# EAGLE board Revolve_A3 (EAGLE 7.7.0), part 1 of 3
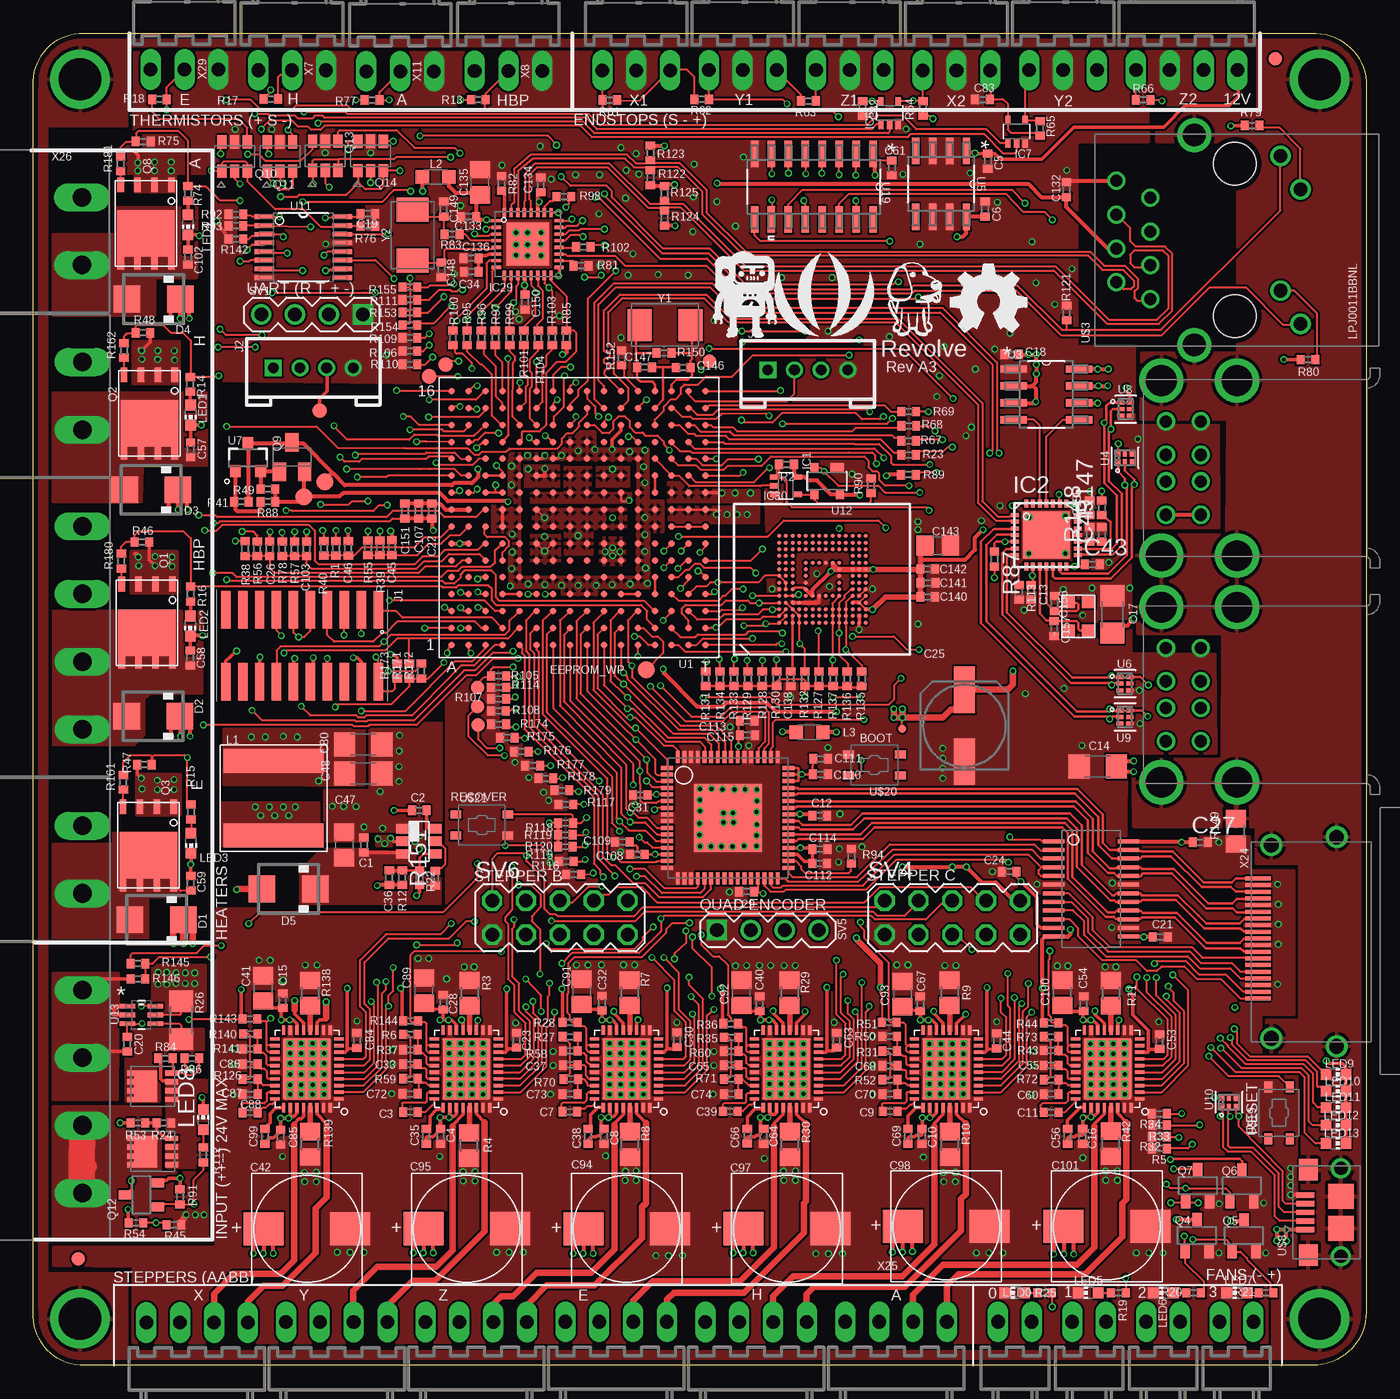
[diagram p9: board, top side]
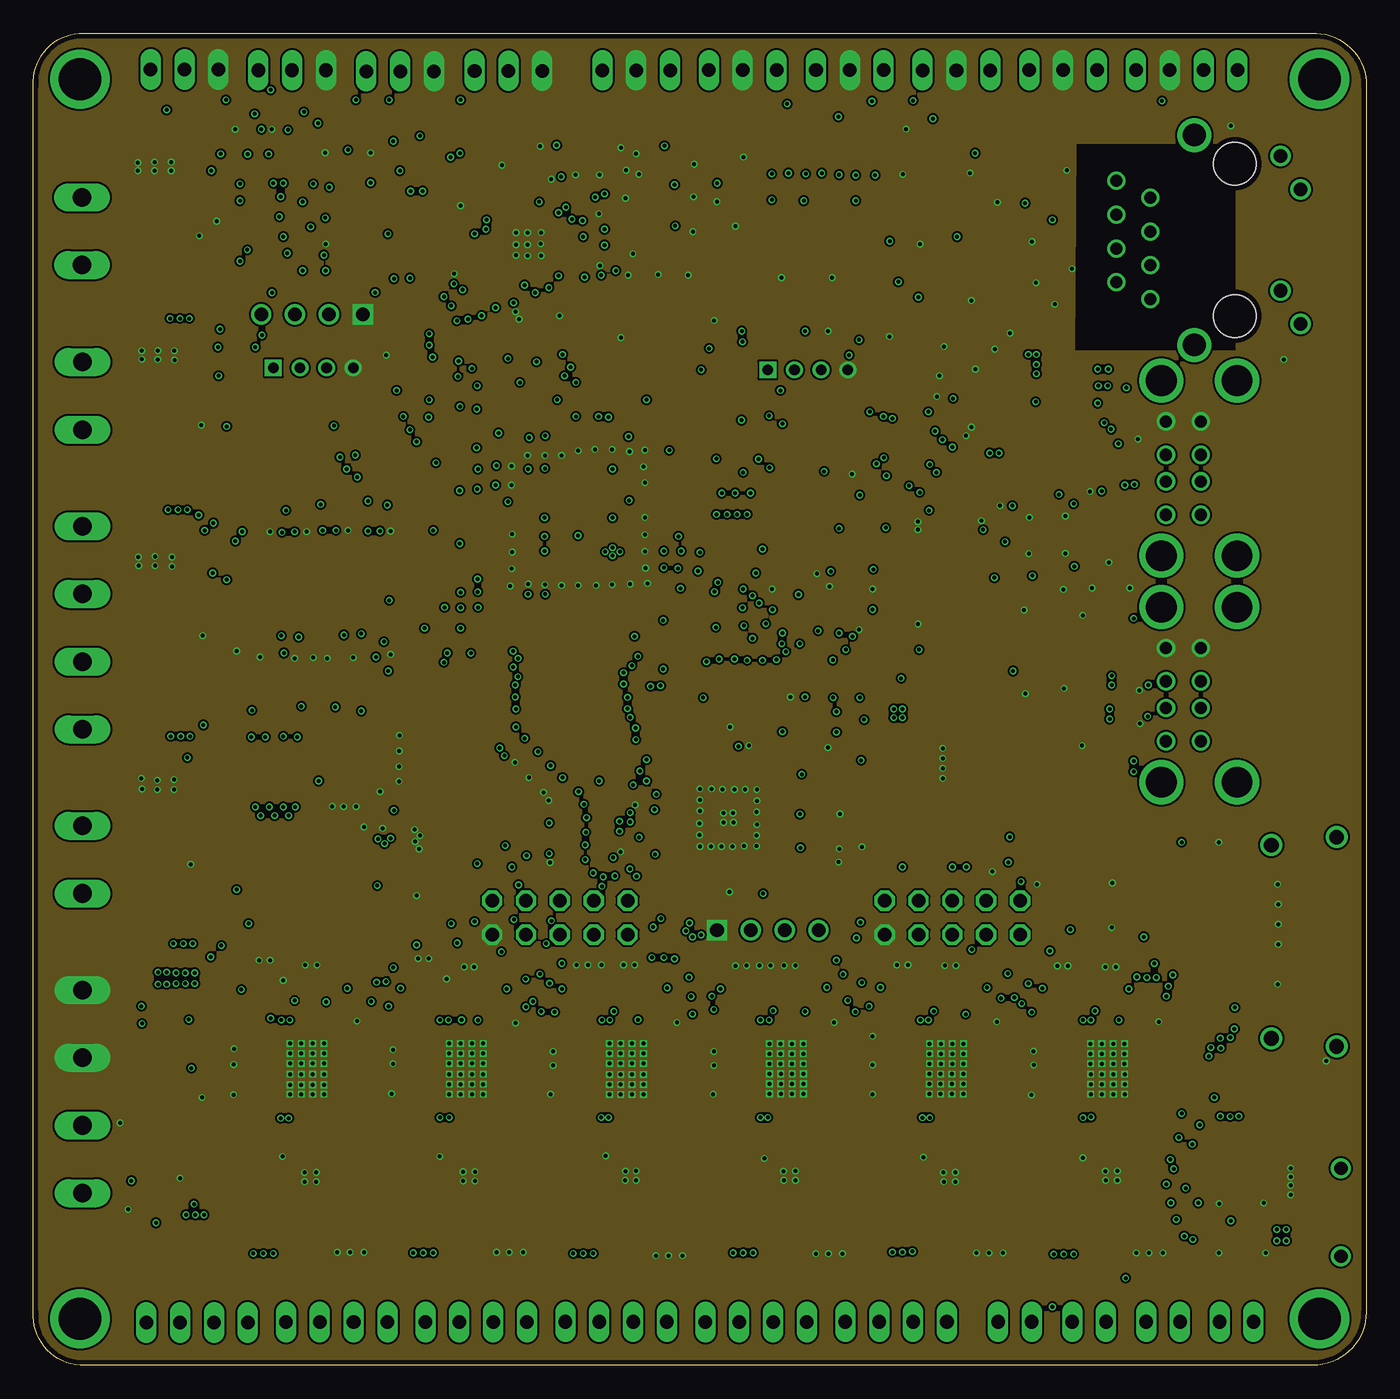
[diagram p10: board, inner layer GND]
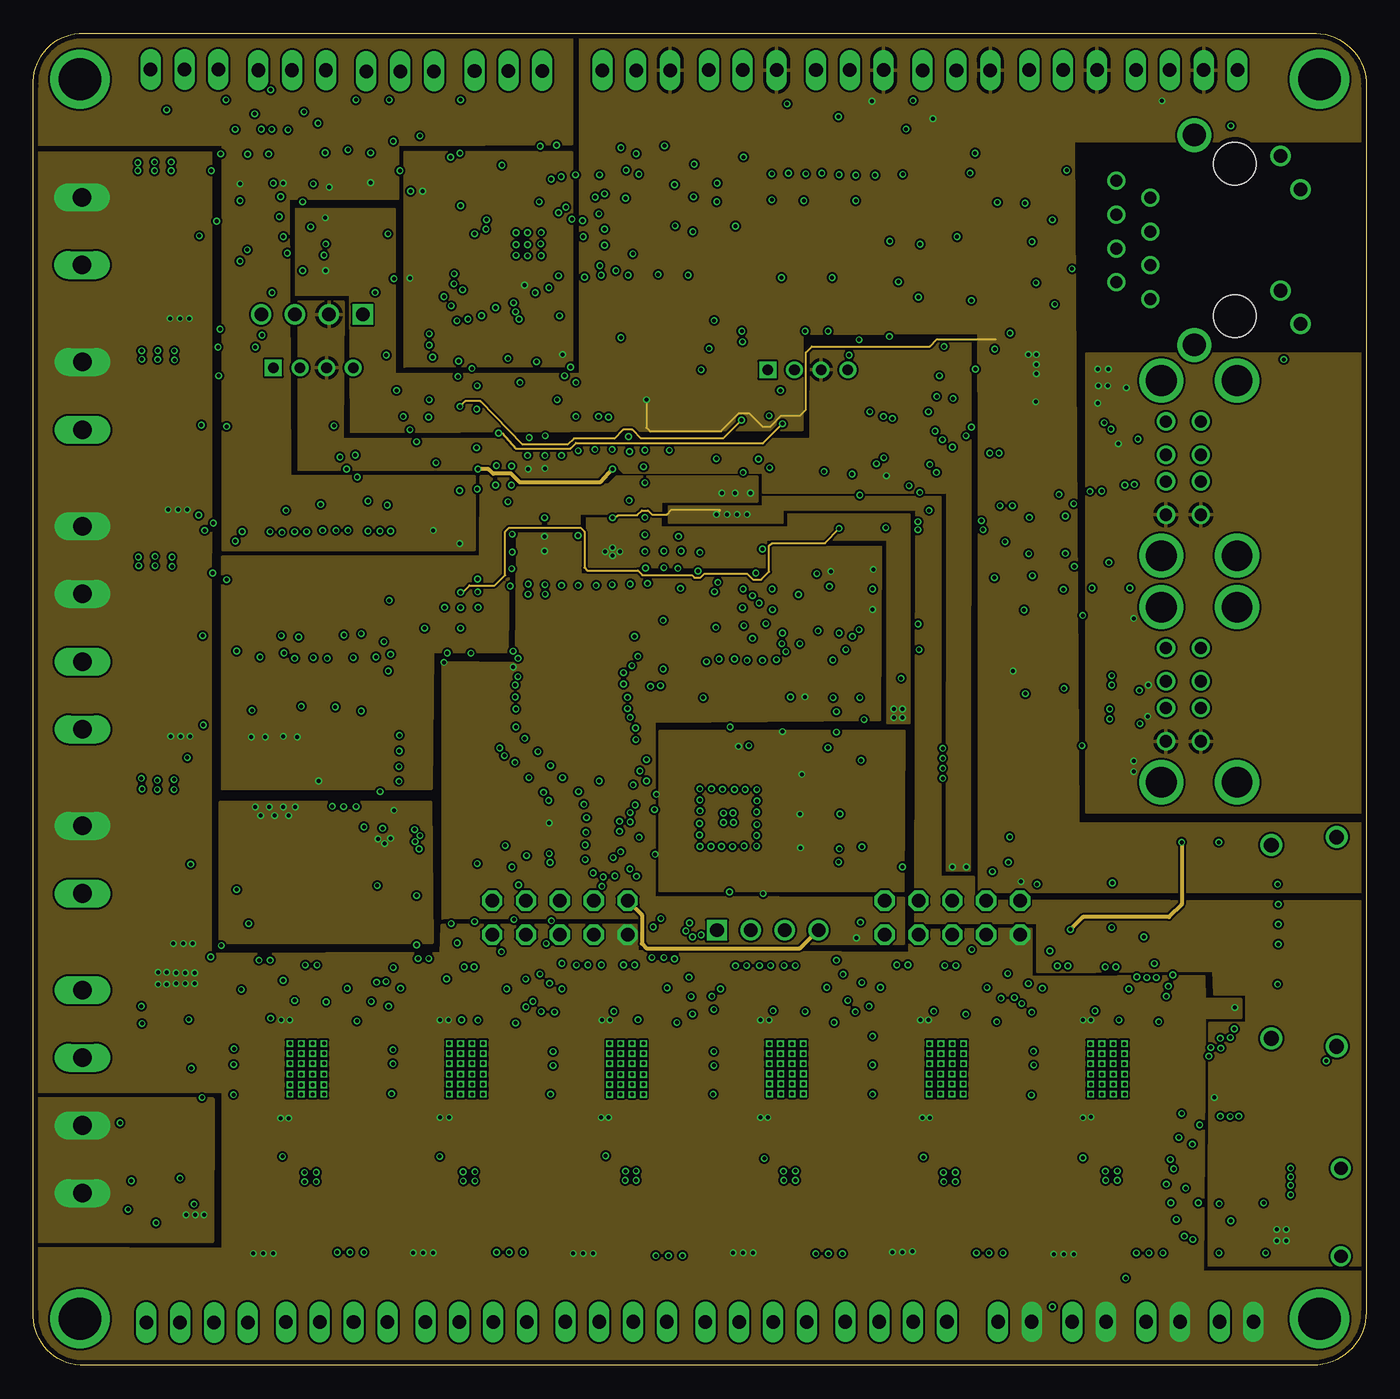
[diagram p11: board, inner layer VCC]
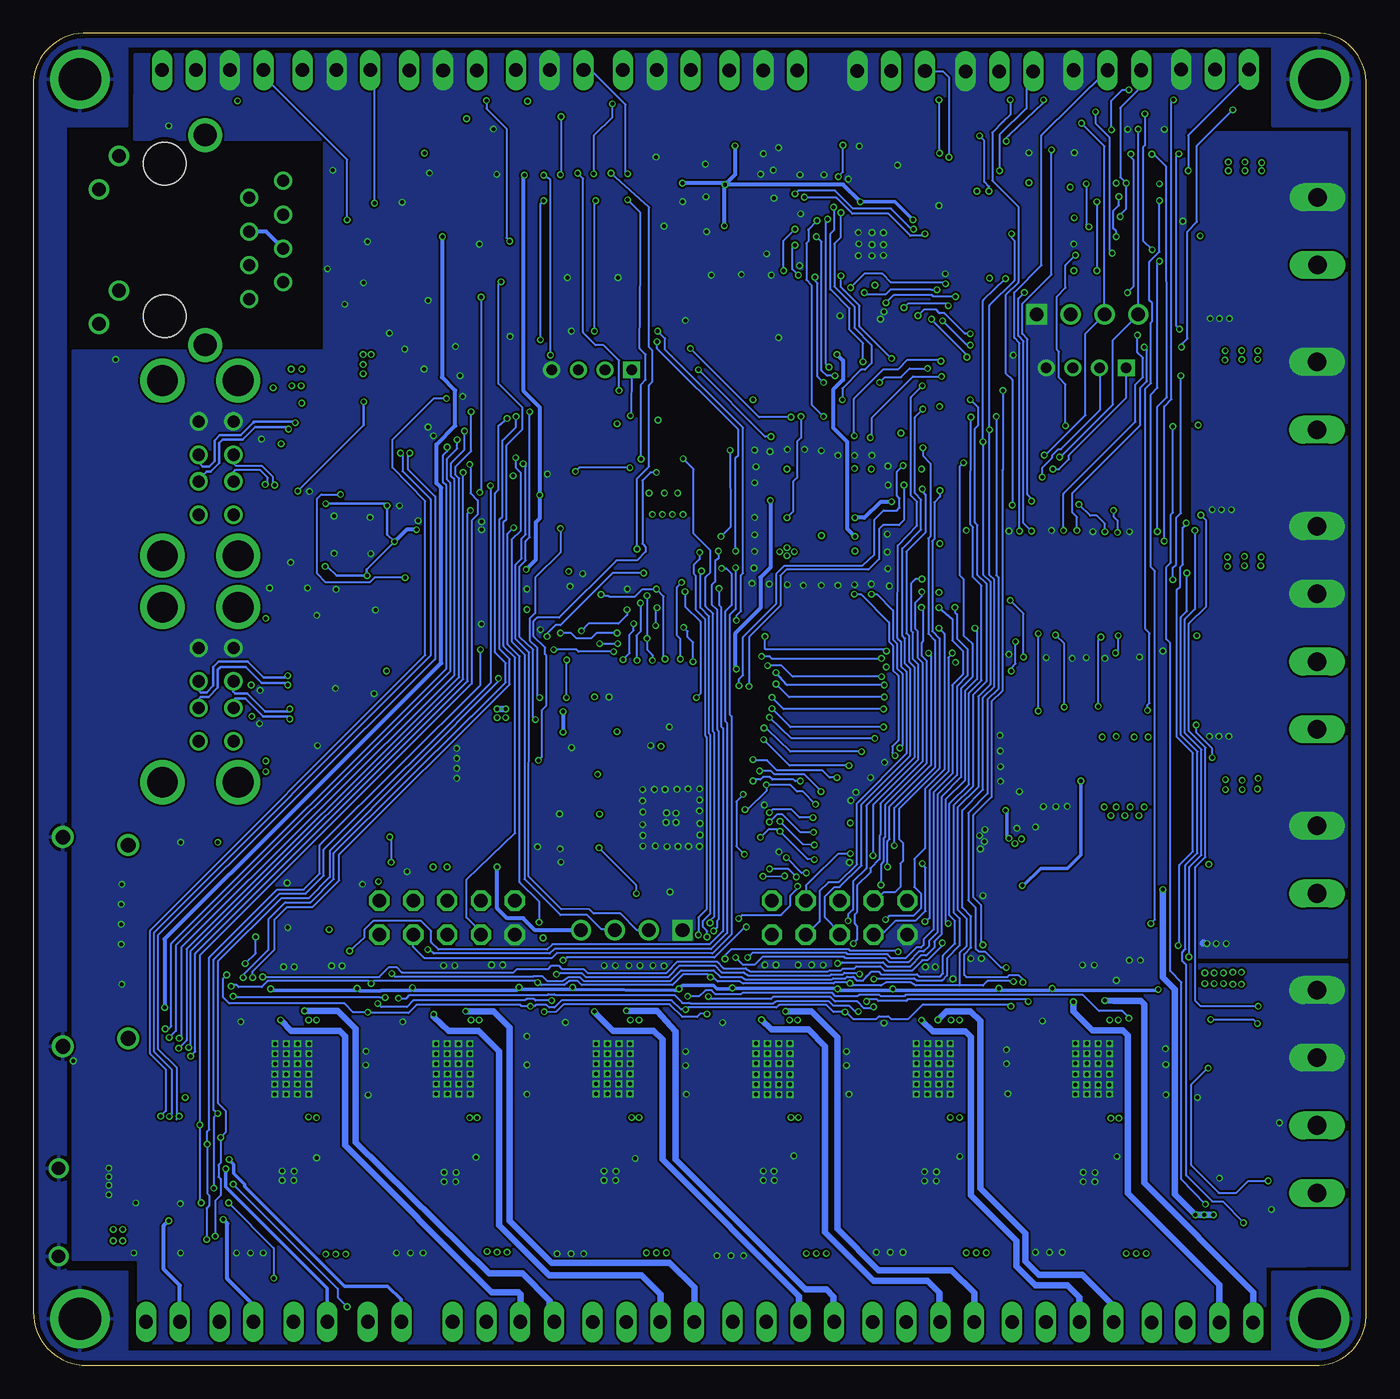
[diagram p12: board, bottom side, seen from below]

Size 100.01 x 99.95 mm. Coordinates in mm from the lower left corner, seen from the top.
Outline: 3.51,0 arc-90 0.01,4 0.01,96 arc-90 3.46,99.95 96.26,99.95 arc-90 100.01,96 100.01,4 arc-90 96.01,0 3.51,0
Copper layers (1*2*3*16): Top 0.035559375mm / dielectric 0.17018125mm / GND 0.01778125mm / dielectric 47mil / VCC 0.0356mm / dielectric 0.2007mm / Bottom 0.035559375mm
Design rules "OSHPark-4layer *": minimum track width 5mil, minimum drill 10mil, track to track 0.15mm, track to pad 0.15mm, pad to pad 0.15mm, via to via 0.15mm, smd to smd 0.1mm, copper to edge 15mil, drill to drill 6mil, minimum pad ring 4mil, minimum via ring 4mil, stop-mask expansion 2.5mil, vias tented up to drill 0.3mm, thermal gap 10mil
Net classes: 0 default: width 0.127 mm, drill 0.254 mm; 1 power: width 0.25 mm

## Footprints (pad centres in the part's own frame; a part is rotated, then mirrored left to right if it is on the bottom)
C0402 = smd 0.6 x 0.7: 1 -0.55,0; 2 0.55,0
C1206 = smd 1.6 x 1.8: 1 -1.4,0; 2 1.4,0
153CLV-0605 = smd 3.5 x 1.6: + 2.7,0; - -2.7,0
C0805 = smd 1.3 x 1.5: 1 -0.95,0; 2 0.95,0
RHS1V10MCN1GS = smd 3 x 2.5: + -3.25,0; - 3.25,0
SMA = smd 2 x 2: A 2,0; C -2,0
B1,27 = smd 1.27 x 1.27: TP 0,0
SC70-5 = smd 0.4 x 0.7: 1 -0.65,-0.85; 2 0,-0.85; 3 0.65,-0.85; 4 0.65,0.85; 5 -0.65,0.85
QFN28 = smd 0.6 x 0.3: 1 -2.35,1.5; 2 -2.35,1; 3 -2.35,0.5; 4 -2.35,0; 5 -2.35,-0.5; 6 -2.35,-1; 7 -2.35,-1.5; 15 2.35,-1.5; 16 2.35,-1; 17 2.35,-0.5; 18 2.35,0; 19 2.35,0.5; 20 2.35,1; 21 2.35,1.5 | smd 0.3 x 0.6: 8 -1.5,-2.35; 9 -1,-2.35; 10 -0.5,-2.35; 11 0,-2.35; 12 0.5,-2.35; 13 1,-2.35; 14 1.5,-2.35; 22 1.5,2.35; 23 1,2.35; 24 0.5,2.35; 25 0,2.35; 26 -0.5,2.35; 27 -1,2.35; 28 -1.5,2.35 | smd 3.5 x 3.5: 29 0,0
32-QFN = smd 0.69 x 0.24: 1 -2.355,1.75; 2 -2.355,1.25; 3 -2.355,0.75; 4 -2.355,0.25; 5 -2.355,-0.25; 6 -2.355,-0.75; 7 -2.355,-1.25; 8 -2.355,-1.75; 17 2.355,-1.75; 18 2.355,-1.25; 19 2.355,-0.75; 20 2.355,-0.25; 21 2.355,0.25; 22 2.355,0.75; 23 2.355,1.25; 24 2.355,1.75 | smd 0.24 x 0.69: 9 -1.75,-2.355; 10 -1.25,-2.355; 11 -0.75,-2.355; 12 -0.25,-2.355; 13 0.25,-2.355; 14 0.75,-2.355; 15 1.25,-2.355; 16 1.75,-2.355; 25 1.75,2.355; 26 1.25,2.355; 27 0.75,2.355; 28 0.25,2.355; 29 -0.25,2.355; 30 -0.75,2.355; 31 -1.25,2.355; 32 -1.75,2.355 | smd 3.2 x 3.2: 33 0,0
WFBGA = smd 0.3 x 0.3: A1 -3.25,3.25; A2 -2.75,3.25; A3 -2.25,3.25; A4 -1.75,3.25; A5 -1.25,3.25; A6 -0.75,3.25; A7 -0.25,3.25; A8 0.25,3.25; A9 0.75,3.25; A10 1.25,3.25; A11 1.75,3.25; A12 2.25,3.25; A13 2.75,3.25; A14 3.25,3.25; B1 -3.25,2.75; B2 -2.75,2.75; B3 -2.25,2.75; B4 -1.75,2.75; B5 -1.25,2.75; B6 -0.75,2.75; B7 -0.25,2.75; B8 0.25,2.75; B9 0.75,2.75; B10 1.25,2.75; B11 1.75,2.75; B12 2.25,2.75; B13 2.75,2.75; B14 3.25,2.75; C1 -3.25,2.25; C2 -2.75,2.25; C3 -2.25,2.25; C4 -1.75,2.25; C5 -1.25,2.25; C6 -0.75,2.25; C7 -0.25,2.25; C8 0.25,2.25; C9 0.75,2.25; C10 1.25,2.25; C11 1.75,2.25; C12 2.25,2.25; C13 2.75,2.25; C14 3.25,2.25; D1 -3.25,1.75; D2 -2.75,1.75; D3 -2.25,1.75; D4 -1.75,1.75; D12 2.25,1.75; D13 2.75,1.75; D14 3.25,1.75; E1 -3.25,1.25; E2 -2.75,1.25; E3 -2.25,1.25; E5 -1.25,1.25; E6 -0.75,1.25; E7 -0.25,1.25; E8 0.25,1.25; E9 0.75,1.25; E10 1.25,1.25; E12 2.25,1.25; E13 2.75,1.25; E14 3.25,1.25; F1 -3.25,0.75; F2 -2.75,0.75; F3 -2.25,0.75; F5 -1.25,0.75; F10 1.25,0.75; F12 2.25,0.75; F13 2.75,0.75; F14 3.25,0.75; G1 -3.25,0.25; G2 -2.75,0.25; G3 -2.25,0.25; G5 -1.25,0.25; G10 1.25,0.25; G12 2.25,0.25; G13 2.75,0.25; G14 3.25,0.25; H1 -3.25,-0.25; H2 -2.75,-0.25; H3 -2.25,-0.25; H5 -1.25,-0.25; H10 1.25,-0.25; H12 2.25,-0.25; H13 2.75,-0.25; H14 3.25,-0.25; J1 -3.25,-0.75; J2 -2.75,-0.75; J3 -2.25,-0.75; J5 -1.25,-0.75; J10 1.25,-0.75; J12 2.25,-0.75; J13 2.75,-0.75; J14 3.25,-0.75; K1 -3.25,-1.25; K2 -2.75,-1.25; K3 -2.25,-1.25; K5 -1.25,-1.25; K6 -0.75,-1.25; K7 -0.25,-1.25; K8 0.25,-1.25; K9 0.75,-1.25; K10 1.25,-1.25; K12 2.25,-1.25; K13 2.75,-1.25; K14 3.25,-1.25; L1 -3.25,-1.75; L2 -2.75,-1.75; L3 -2.25,-1.75; L12 2.25,-1.75; L13 2.75,-1.75; L14 3.25,-1.75; M1 -3.25,-2.25; M2 -2.75,-2.25; M3 -2.25,-2.25; M4 -1.75,-2.25; M5 -1.25,-2.25; M6 -0.75,-2.25; M7 -0.25,-2.25; M8 0.25,-2.25; M9 0.75,-2.25; M10 1.25,-2.25; M11 1.75,-2.25; M12 2.25,-2.25; M13 2.75,-2.25; M14 3.25,-2.25; N1 -3.25,-2.75; N2 -2.75,-2.75; N3 -2.25,-2.75; N4 -1.75,-2.75; N5 -1.25,-2.75; N6 -0.75,-2.75; N7 -0.25,-2.75; N8 0.25,-2.75; N9 0.75,-2.75; N10 1.25,-2.75; N11 1.75,-2.75; N12 2.25,-2.75; N13 2.75,-2.75; N14 3.25,-2.75; P1 -3.25,-3.25; P2 -2.75,-3.25; P3 -2.25,-3.25; P4 -1.75,-3.25; P5 -1.25,-3.25; P6 -0.75,-3.25; P7 -0.25,-3.25; P8 0.25,-3.25; P9 0.75,-3.25; P10 1.25,-3.25; P11 1.75,-3.25; P12 2.25,-3.25; P13 2.75,-3.25; P14 3.25,-3.25
CTI-JTAG = smd 2.794 x 0.711: 1 -2.705,5.715; 2 2.705,5.715; 3 -2.705,4.445; 4 2.705,4.445; 5 -2.705,3.175; 6 2.705,3.175; 7 -2.705,1.905; 8 2.705,1.905; 9 -2.705,0.635; 10 2.705,0.635; 11 -2.705,-0.635; 12 2.705,-0.635; 13 -2.705,-1.905; 14 2.705,-1.905; 15 -2.705,-3.175; 16 2.705,-3.175; 17 -2.705,-4.445; 18 2.705,-4.445; 19 -2.705,-5.715; 20 2.705,-5.715
HW4-2.0 = drill 0.8 pad 1.27 square: 1 -3,0 | drill 0.8 pad 1.27: 2 -1,0; 3 1,0; 4 3,0
FIDUCIAL-1X2.5 = smd 1 x 1: 1 0,0
NR8040T330 = smd 1.8 x 7.5: P$1 2.8,0; P$2 -2.8,0
L2012C = smd 1 x 1: 1 -1,0; 2 1,0
CHIP-LED0603 = smd 0.8 x 0.8: A 0,-0.75; C 0,0.75
MOUNTING_HOLE = drill 3.175 pad 4.445: P$1 0,0
TP10R = smd 1 x 1: TP 0,0
8-DFN-EP-(5X6) = smd 1.1 x 0.5: 1 -2.9,1.905; 2 -2.9,0.635; 3 -2.9,-0.635; 4 -2.9,-1.905; 5 2.9,-1.905; 6 2.9,-0.635; 7 2.9,0.635; 8 2.9,1.905 | smd 3.5 x 4.3: TH 0.75,0
SOT23 = smd 0.7 x 1: 1 -0.9,-1.2; 2 0.9,-1.2; 3 0,1.2
SOT23-BEC = smd 1 x 1.4: B -0.95,-1.1; C 0,1.1; E 0.95,-1.1
TSOT26 = smd 0.7 x 1: 1 -0.95,-1.1; 2 0,-1.1; 3 0.95,-1.1; 4 0.95,1.1; 5 0,1.1; 6 -0.95,1.1
R0402 = smd 0.6 x 0.7: 1 -0.55,0; 2 0.55,0
R0805 = smd 1.3 x 1.5: 1 -0.95,0; 2 0.95,0
R1206 = smd 1.6 x 1.803: 1 -1.422,0; 2 1.422,0
MA04-1 = drill 1.016 square: 1 -3.81,0 | drill 1.016: 2 -1.27,0; 3 1.27,0; 4 3.81,0
MA05-2 = drill 1.016 octagon: 1 -5.08,-1.27; 2 -5.08,1.27; 3 -2.54,-1.27; 4 -2.54,1.27; 5 0,-1.27; 6 0,1.27; 7 2.54,-1.27; 8 2.54,1.27; 9 5.08,-1.27; 10 5.08,1.27
TP06R = smd 0.6 x 0.6: TP 0,0
TP11R = smd 1.1 x 1.1: TP 0,0
OSD335X-BGA-256 = smd 0.5 x 0.5: A1 -9.525,-9.525; A2 -9.525,-8.255; A3 -9.525,-6.985; A4 -9.525,-5.715; A5 -9.525,-4.445; A6 -9.525,-3.175; A7 -9.525,-1.905; A8 -9.525,-0.635; A9 -9.525,0.635; A10 -9.525,1.905; A11 -9.525,3.175; A12 -9.525,4.445; A13 -9.525,5.715; A14 -9.525,6.985; A15 -9.525,8.255; A16 -9.525,9.525; B1 -8.255,-9.525; B2 -8.255,-8.255; B3 -8.255,-6.985; B4 -8.255,-5.715; B5 -8.255,-4.445; B6 -8.255,-3.175; B7 -8.255,-1.905; B8 -8.255,-0.635; B9 -8.255,0.635; B10 -8.255,1.905; B11 -8.255,3.175; B12 -8.255,4.445; B13 -8.255,5.715; B14 -8.255,6.985; B15 -8.255,8.255; B16 -8.255,9.525; C1 -6.985,-9.525; C2 -6.985,-8.255; C3 -6.985,-6.985; C4 -6.985,-5.715; C5 -6.985,-4.445; C6 -6.985,-3.175; C7 -6.985,-1.905; C8 -6.985,-0.635; C9 -6.985,0.635; C10 -6.985,1.905; C11 -6.985,3.175; C12 -6.985,4.445; C13 -6.985,5.715; C14 -6.985,6.985; C15 -6.985,8.255; C16 -6.985,9.525; D1 -5.715,-9.525; D2 -5.715,-8.255; D3 -5.715,-6.985; D4 -5.715,-5.715; D5 -5.715,-4.445; D6 -5.715,-3.175; D7 -5.715,-1.905; D8 -5.715,-0.635; D9 -5.715,0.635; D10 -5.715,1.905; D11 -5.715,3.175; D12 -5.715,4.445; D13 -5.715,5.715; D14 -5.715,6.985; D15 -5.715,8.255; D16 -5.715,9.525; E1 -4.445,-9.525; E2 -4.445,-8.255; E3 -4.445,-6.985; E4 -4.445,-5.715; E5 -4.445,-4.445; E6 -4.445,-3.175; E7 -4.445,-1.905; E8 -4.445,-0.635; E9 -4.445,0.635; E10 -4.445,1.905; E11 -4.445,3.175; E12 -4.445,4.445; E13 -4.445,5.715; E14 -4.445,6.985; E15 -4.445,8.255; E16 -4.445,9.525; F1 -3.175,-9.525; F2 -3.175,-8.255; F3 -3.175,-6.985; F4 -3.175,-5.715; F5 -3.175,-4.445; F6 -3.175,-3.175; F7 -3.175,-1.905; F8 -3.175,-0.635; F9 -3.175,0.635; F10 -3.175,1.905; F11 -3.175,3.175; F12 -3.175,4.445; F13 -3.175,5.715; F14 -3.175,6.985; F15 -3.175,8.255; F16 -3.175,9.525; G1 -1.905,-9.525; G2 -1.905,-8.255; G3 -1.905,-6.985; G4 -1.905,-5.715; G5 -1.905,-4.445; G6 -1.905,-3.175; G7 -1.905,-1.905; G8 -1.905,-0.635; G9 -1.905,0.635; G10 -1.905,1.905; G11 -1.905,3.175; G12 -1.905,4.445; G13 -1.905,5.715; G14 -1.905,6.985; G15 -1.905,8.255; G16 -1.905,9.525; H1 -0.635,-9.525; H2 -0.635,-8.255; H3 -0.635,-6.985; H4 -0.635,-5.715; H5 -0.635,-4.445; H6 -0.635,-3.175; H7 -0.635,-1.905; H8 -0.635,-0.635; H9 -0.635,0.635; H10 -0.635,1.905; H11 -0.635,3.175; H12 -0.635,4.445; H13 -0.635,5.715; H14 -0.635,6.985; H15 -0.635,8.255; H16 -0.635,9.525; J1 0.635,-9.525; J2 0.635,-8.255; J3 0.635,-6.985; J4 0.635,-5.715; J5 0.635,-4.445; J6 0.635,-3.175; J7 0.635,-1.905; J8 0.635,-0.635; J9 0.635,0.635; J10 0.635,1.905; J11 0.635,3.175; J12 0.635,4.445; J13 0.635,5.715; J14 0.635,6.985; J15 0.635,8.255; J16 0.635,9.525; K1 1.905,-9.525; K2 1.905,-8.255; K3 1.905,-6.985; K4 1.905,-5.715; K5 1.905,-4.445; K6 1.905,-3.175; K7 1.905,-1.905; K8 1.905,-0.635; K9 1.905,0.635; K10 1.905,1.905; K11 1.905,3.175; K12 1.905,4.445; K13 1.905,5.715; K14 1.905,6.985; K15 1.905,8.255; K16 1.905,9.525; L1 3.175,-9.525; L2 3.175,-8.255; L3 3.175,-6.985; L4 3.175,-5.715; L5 3.175,-4.445; L6 3.175,-3.175; L7 3.175,-1.905; L8 3.175,-0.635; L9 3.175,0.635; L10 3.175,1.905; L11 3.175,3.175; L12 3.175,4.445; L13 3.175,5.715; L14 3.175,6.985; L15 3.175,8.255; L16 3.175,9.525; M1 4.445,-9.525; M2 4.445,-8.255; M3 4.445,-6.985; M4 4.445,-5.715; M5 4.445,-4.445; M6 4.445,-3.175; M7 4.445,-1.905; M8 4.445,-0.635; M9 4.445,0.635; M10 4.445,1.905; M11 4.445,3.175; M12 4.445,4.445; M13 4.445,5.715; M14 4.445,6.985; M15 4.445,8.255; M16 4.445,9.525; N1 5.715,-9.525; N2 5.715,-8.255; N3 5.715,-6.985; N4 5.715,-5.715; N5 5.715,-4.445; N6 5.715,-3.175; N7 5.715,-1.905; N8 5.715,-0.635; N9 5.715,0.635; N10 5.715,1.905; N11 5.715,3.175; N12 5.715,4.445; N13 5.715,5.715; N14 5.715,6.985; N15 5.715,8.255; N16 5.715,9.525; P1 6.985,-9.525; P2 6.985,-8.255; P3 6.985,-6.985; P4 6.985,-5.715; P5 6.985,-4.445; P6 6.985,-3.175; P7 6.985,-1.905; P8 6.985,-0.635; P9 6.985,0.635; P10 6.985,1.905; P11 6.985,3.175; P12 6.985,4.445; P13 6.985,5.715; P14 6.985,6.985; P15 6.985,8.255; P16 6.985,9.525; R1 8.255,-9.525; R2 8.255,-8.255; R3 8.255,-6.985; R4 8.255,-5.715; R5 8.255,-4.445; R6 8.255,-3.175; R7 8.255,-1.905; R8 8.255,-0.635; R9 8.255,0.635; R10 8.255,1.905; R11 8.255,3.175; R12 8.255,4.445; R13 8.255,5.715; R14 8.255,6.985; R15 8.255,8.255; R16 8.255,9.525; T1 9.525,-9.525; T2 9.525,-8.255; T3 9.525,-6.985; T4 9.525,-5.715; T5 9.525,-4.445; T6 9.525,-3.175; T7 9.525,-1.905; T8 9.525,-0.635; T9 9.525,0.635; T10 9.525,1.905; T11 9.525,3.175; T12 9.525,4.445; T13 9.525,5.715; T14 9.525,6.985; T15 9.525,8.255; T16 9.525,9.525
SOIC127P600X175-8N = smd 1.981 x 0.559: 1 -2.464,1.905; 2 -2.464,0.635; 3 -2.464,-0.635; 4 -2.464,-1.905; 5 2.464,-1.905; 6 2.464,-0.635; 7 2.464,0.635; 8 2.464,1.905
DRY6 = smd 0.55 x 0.3: 1 -0.355,0.5 | smd 0.52 x 0.3: 2 -0.37,0; 3 -0.37,-0.5; 4 0.37,-0.5; 5 0.37,0; 6 0.37,0.5
SOT23-3 = smd 0.8 x 0.9: 1 -0.95,-1; 2 0.95,-1; 3 0,1.1
SOP65P640X120-16N = smd 1.473 x 0.356: 1 -2.921,2.286; 2 -2.921,1.626; 3 -2.921,0.965; 4 -2.921,0.33; 5 -2.921,-0.33; 6 -2.921,-0.965; 7 -2.921,-1.626; 8 -2.921,-2.286; 9 2.921,-2.286; 10 2.921,-1.626; 11 2.921,-0.965; 12 2.921,-0.33; 13 2.921,0.33; 14 2.921,0.965; 15 2.921,1.626; 16 2.921,2.286
SOT143-R = smd 1 x 0.7: 1 -0.75,-1 | smd 0.6 x 0.7: 2 0.95,-1; 3 0.95,1; 4 -0.95,1
SOT65P210X110-6N = smd 1.168 x 0.356: 1 -1.041,0.66; 2 -1.041,0; 3 -1.041,-0.66; 4 1.041,-0.66; 5 1.041,0; 6 1.041,0.66
SOIC127P600X175-16N = smd 1.981 x 0.559: 1 -2.464,4.445; 2 -2.464,3.175; 3 -2.464,1.905; 4 -2.464,0.635; 5 -2.464,-0.635; 6 -2.464,-1.905; 7 -2.464,-3.175; 8 -2.464,-4.445; 9 2.464,-4.445; 10 2.464,-3.175; 11 2.464,-1.905; 12 2.464,-0.635; 13 2.464,0.635; 14 2.464,1.905; 15 2.464,3.175; 16 2.464,4.445
TRINAMIC_QFN36 = smd 0.7 x 0.25: 1 -2.4,2.25; 2 -2.4,1.75; 3 -2.4,1.25; 4 -2.4,0.75; 5 -2.4,0.25; 6 -2.4,-0.25; 7 -2.4,-0.75; 8 -2.4,-1.25; 9 -2.4,-1.75; 10 -2.4,-2.25; 19 2.4,-2.25; 20 2.4,-1.75; 21 2.4,-1.25; 22 2.4,-0.75; 23 2.4,-0.25; 24 2.4,0.25; 25 2.4,0.75; 26 2.4,1.25; 27 2.4,1.75; 28 2.4,2.25 | smd 0.25 x 0.7: 11 -1.75,-2.9; 12 -1.25,-2.9; 13 -0.75,-2.9; 14 -0.25,-2.9; 15 0.25,-2.9; 16 0.75,-2.9; 17 1.25,-2.9; 18 1.75,-2.9; 29 1.75,2.9; 30 1.25,2.9; 31 0.75,2.9; 32 0.25,2.9; 33 -0.25,2.9; 34 -0.75,2.9; 35 -1.25,2.9; 36 -1.75,2.9 | smd 3.6 x 4.6: GND_PAD 0,0
LPJ0011BBNL = drill 0.9: 1 -4.445,6.35; 2 -3.175,8.89; 3 -1.905,6.35; 4 -0.635,8.89; 5 0.635,6.35; 6 1.905,8.89; 7 3.175,6.35; 8 4.445,8.89 | drill 1.02: 9 -6.3,-4.9; 10 -3.8,-3.4; 11 3.8,-4.9; 12 6.3,-3.4 | drill 1.7: SHD1 -7.875,3.05; SHD2 7.875,3.05 | hole 3.2: -5.715,0; 5.715,0
USB-A = drill 0.92: 1 -3.5,5.33; 2 -1,5.33; 3 1,5.33; 4 3.5,5.33; 5 -3.5,2.71; 6 -1,2.71; 7 1,2.71; 8 3.5,2.71 | drill 2.3: A9 -6.57,0; A10 6.57,0; A11 -6.57,5.68; A12 6.57,5.68
SOT804-4 = smd 0.9 x 0.29: 1 -4.55,3.75; 2 -4.55,3.25; 3 -4.55,2.75; 4 -4.55,2.25; 5 -4.55,1.75; 6 -4.55,1.25; 7 -4.55,0.75; 8 -4.55,0.25; 9 -4.55,-0.25; 10 -4.55,-0.75; 11 -4.55,-1.25; 12 -4.55,-1.75; 13 -4.55,-2.25; 14 -4.55,-2.75; 15 -4.55,-3.25; 16 -4.55,-3.75; 33 4.55,-3.75; 34 4.55,-3.25; 35 4.55,-2.75; 36 4.55,-2.25; 37 4.55,-1.75; 38 4.55,-1.25; 39 4.55,-0.75; 40 4.55,-0.25; 41 4.55,0.25; 42 4.55,0.75; 43 4.55,1.25; 44 4.55,1.75; 45 4.55,2.25; 46 4.55,2.75; 47 4.55,3.25; 48 4.55,3.75 | smd 0.29 x 0.9: 17 -3.75,-4.55; 18 -3.25,-4.55; 19 -2.75,-4.55; 20 -2.25,-4.55; 21 -1.75,-4.55; 22 -1.25,-4.55; 23 -0.75,-4.55; 24 -0.25,-4.55; 25 0.25,-4.55; 26 0.75,-4.55; 27 1.25,-4.55; 28 1.75,-4.55; 29 2.25,-4.55; 30 2.75,-4.55; 31 3.25,-4.55; 32 3.75,-4.55; 49 3.75,4.55; 50 3.25,4.55; 51 2.75,4.55; 52 2.25,4.55; 53 1.75,4.55; 54 1.25,4.55; 55 0.75,4.55; 56 0.25,4.55; 57 -0.25,4.55; 58 -0.75,4.55; 59 -1.25,4.55; 60 -1.75,4.55; 61 -2.25,4.55; 62 -2.75,4.55; 63 -3.25,4.55; 64 -3.75,4.55 | smd 5.1 x 5.1: P$1 0,0
USB-MICRO = smd 0.4 x 1.35: P$1 -1.3,2.675; P$2 -0.65,2.675; P$3 0,2.675; P$4 0.65,2.675; P$5 1.3,2.675 | smd 1.6 x 1.4: P$6 -3.2,2.45; P$7 3.2,2.45 | smd 1.9 x 1.9: P$8 -1.2,0; P$9 1.2,0 | drill 1: P$10 -3.3,0; P$11 3.3,0
SOT23' = smd 0.7 x 1: 1 -0.95,-1.2; 2 0,-1.2; 3 0.95,-1.2; 4 0.95,1.2; 5 0,1.2; 6 -0.95,1.2
POWERPAK-1212-8S = smd 0.99 x 0.405: D1 1.435,0.99; D2 1.435,0.33; D3 1.435,-0.33; D4 1.435,-0.99; G -1.435,-0.99; S1 -1.435,0.99; S2 -1.435,0.33; S3 -1.435,-0.33 | smd 1.725 x 2.35: D5 0.54,0
R-PDSO-G24 = smd 0.3 x 1.6: P$1 -3.575,-2.8; P$2 -2.925,-2.8; P$3 -2.275,-2.8; P$4 -1.625,-2.8; P$5 -0.975,-2.8; P$6 -0.325,-2.8; P$7 0.325,-2.8; P$8 0.975,-2.8; P$9 1.625,-2.8; P$10 2.275,-2.8; P$11 2.925,-2.8; P$12 3.575,-2.8; P$13 3.575,2.8; P$14 2.925,2.8; P$15 2.275,2.8; P$16 1.625,2.8; P$17 0.975,2.8; P$18 0.325,2.8; P$19 -0.325,2.8; P$20 -0.975,2.8; P$21 -1.625,2.8; P$22 -2.275,2.8; P$23 -2.925,2.8; P$24 -3.575,2.8
DHT-1147 = smd 0.8 x 0.6: 1 -1.95,0.8; 2 1.95,0.8; 3 -1.95,-0.8; 4 1.95,-0.8
403C35E12M00000 = smd 0.9 x 1: P$1 -1.075,-0.775; P$2 1.075,-0.775; P$3 1.075,0.775; P$4 -1.075,0.775
7395-03 = drill 1.016 long: 1 2.54,0; 2 0,0; 3 -2.54,0
MSTBA4 = drill 1.397 long: 1 -7.62,5.08; 2 -2.54,5.08; 3 2.54,5.08; 4 7.62,5.08
MSTBA2 = drill 1.397 long: 1 -2.54,5.08; 2 2.54,5.08
7395-02 = drill 1.016 long: 1 1.27,0; 2 -1.27,0
7395-04 = drill 1.016 long: 1 3.81,0; 2 1.27,0; 3 -1.27,0; 4 -3.81,0
HDMI-A-TH = smd 0.3 x 1.9: 1 4.75,5.9; 2 4.25,5.9; 3 3.75,5.9; 4 3.25,5.9; 5 2.75,5.9; 6 2.25,5.9; 7 1.75,5.9; 8 1.25,5.9; 9 0.75,5.9; 10 0.25,5.9; 11 -0.25,5.9; 12 -0.75,5.9; 13 -1.25,5.9; 14 -1.75,5.9; 15 -2.25,5.9; 16 -2.75,5.9; 17 -3.25,5.9; 18 -3.75,5.9; 19 -4.25,5.9 | drill 1.1: P$1 -7.25,4.9; P$2 -7.85,0; P$3 7.25,4.9; P$4 7.85,0
445C33D24M00000 = smd 1.8 x 2.4: P$1 -1.9,0; P$2 1.9,0

## Placement (x,y rotation side)
C1  0.1uF  [C0402]  24.81,39.05 270 top
C2  0.1uF  [C0402]  28.96,41.65 0 top
C3  22nF  [C0402]  28.3,19.01 180 top
C4  0.1uF  [C0402]  30.55,17.19 270 top
C5  0.1uF  [C0402]  71.61,90.35 90 top
C6  0.1uF  [C0402]  71.41,86.75 270 top
C7  22nF  [C0402]  40.25,19.04 180 top
C8  0.1uF  [C0402]  42.82,17.19 270 top
C9  22nF  [C0402]  64.3,19.07 180 top
C10  0.1uF  [C0402]  66.67,17.19 270 top
C11  22nF  [C0402]  76.37,18.99 180 top
C12  0.1uF  [C0402]  59.01,41.25 0 top
C13  0.1uF  [C0402]  74.86,58 270 top
C14  22uF  [C1206]  79.86,44.95 180 top
C15  0.1uF  [C0402]  18.72,27.37 90 top
C16  0.1uF  [C0402]  78.72,17.19 270 top
C17  22uF  [C1206]  80.96,56.35 90 top
C18  0.1uF  [C0402]  73.41,75.85 0 top
C19  0.1uF  [C0402]  25.11,86.4 0 top
C20  0.1uF  [C0402]  7.06,24.1 90 top
C21  0.1uF  [C0402]  84.57,32.15 0 top
C22  4.7nF  [C0402]  29.91,64.1 90 top
C23  0.1uF  [C0402]  36.26,24.4 90 top
C24  0.1uF  [C0402]  73.21,37.05 180 top
C25  100uF  [153CLV-0605]  69.86,48 90 top
C26  4.7uF  [C0402]  17.74,61.28 90 top
C27  0.1uF  [C0402]  87.56,39.25 0 top
C28  0.1uF  [C0402]  30.77,27.25 270 top
C29  0.1uF  [C0402]  53.51,35.55 180 top
C30  0.1uF  [C0402]  48.3,24.45 90 top
C31  0.1uF  [C0402]  45.54,42.8 180 top
C32  0.1uF  [C0402]  42.67,27.19 270 top
C33  4.7uF  [C0402]  28.29,22.61 0 top
C34  2.2uF  [C0402]  32.86,82.05 180 top
C35  0.1uF  [C0402]  29.48,17.19 270 top
C36  18pF  [C0402]  26.71,36.6 270 top
C37  4.7uF  [C0402]  40.3,22.54 0 top
C38  0.1uF  [C0402]  41.62,17.19 270 top
C39  22nF  [C0402]  52.3,19.07 180 top
C40  0.1uF  [C0402]  54.49,27.14 90 top
C41  10uF,35V  [C0805]  17.25,28.3 90 top
C42  100uF,35V,0.025R  [RHS1V10MCN1GS]  20.53,10.25 0 top
C43  0.1uF  [C0402]  79.46,60.1 0 top
C44  0.1uF  [C0402]  72.29,24.35 90 top
C45  4.7uF  [C0402]  26.91,61.36 90 top
C46  4.7uF  [C0402]  23.64,61.31 90 top
C47  10uF,35V  [C0805]  23.33,39.05 90 top
C48  22uF  [C1206]  24.76,44.42 0 top
C49  4.7uF  [C0402]  80.16,62.35 90 top
C53  0.1uF  [C0402]  84.5,24.3 90 top
C54  0.1uF  [C0402]  78.8,27.14 270 top
C55  4.7uF  [C0402]  76.37,22.51 0 top
C56  0.1uF  [C0402]  77.6,17.19 270 top
C57  4.7nF  [C0402]  11.81,68.7 90 top
C58  4.7nF  [C0402]  11.78,53.08 90 top
C59  4.7nF  [C0402]  11.82,36.18 90 top
C60  0.1uF  [C0402]  76.37,20.36 180 top
C61  0.1uF  [C0402]  64.41,89.84 270 top
C63  0.1uF  [C0402]  60.27,24.4 90 top
C64  0.1uF  [C0402]  54.79,17.19 90 top
C65  4.7uF  [C0402]  52.37,22.54 0 top
C66  0.1uF  [C0402]  53.57,17.21 270 top
C67  0.1uF  [C0402]  66.55,27.14 270 top
C68  4.7uF  [C0402]  64.27,22.48 0 top
C69  0.1uF  [C0402]  65.62,17.19 270 top
C70  0.1uF  [C0402]  64.27,20.36 180 top
C72  0.1uF  [C0402]  28.27,20.39 180 top
C73  0.1uF  [C0402]  40.27,20.36 180 top
C74  0.1uF  [C0402]  52.37,20.36 180 top
C80  22uF  [C1206]  24.76,46.6 0 top
C82  0.1uF  [C0402]  62.22,94.31 270 top
C83  0.1uF  [C0402]  71.22,94.97 180 top
C84  0.1uF  [C0402]  24.29,24.39 90 top
C85  0.1uF  [C0402]  18.56,17.12 90 top
C86  4.7uF  [C0402]  16.27,22.6 0 top
C87  0.1uF  [C0402]  16.27,20.35 180 top
C88  22nF  [C0402]  16.27,18.97 180 top
C89  10uF,35V  [C0805]  29.31,28.12 90 top
C91  10uF,35V  [C0805]  41.15,28.04 90 top
C92  10uF,35V  [C0805]  53.12,27.96 90 top
C93  10uF,35V  [C0805]  65.22,27.86 90 top
C94  100uF,35V,0.025R  [RHS1V10MCN1GS]  44.53,10.26 0 top
C95  100uF,35V,0.025R  [RHS1V10MCN1GS]  32.52,10.27 0 top
C97  100uF,35V,0.025R  [RHS1V10MCN1GS]  56.55,10.26 0 top
C98  100uF,35V,0.025R  [RHS1V10MCN1GS]  68.5,10.44 0 top
C99  0.1uF  [C0402]  17.39,17.19 270 top
C100  10uF,35V  [C0805]  77.2,27.96 90 top
C101  100uF,35V,0.025R  [RHS1V10MCN1GS]  80.55,10.44 0 top
C102  4.7nF  [C0402]  11.61,83.15 90 top
C103  4.7uF  [C0402]  20.51,61.27 90 top
C107  0.1uF  [C0402]  28.91,64.1 90 top
C108  0.1uF  [C0402]  45.32,38.34 180 top
C109  2.2uF  [C0402]  44.19,39.27 180 top
C110  0.1uF  [C0402]  59.06,44.35 0 top
C111  2.2uF  [C0402]  59.08,45.52 0 top
C112  2.2uF  [C0402]  58.99,37.67 0 top
C113  2.2uF  [C0402]  53.56,48.37 0 top
C114  0.1uF  [C0402]  59.02,38.73 0 top
C115  0.1uF  [C0402]  53.58,47.28 0 top
C132  22nF  [C0402]  77.52,88.22 90 top
C133  0.1uF  [C0402]  32.66,86.19 180 top
C134  0.1uF  [C0402]  38.08,88.58 90 top
C135  10uF,3.3V  [C0805]  33.52,88.77 90 top
C136  470pF  [C0402]  32.85,83.06 180 top
C138  0.1uF  [C0402]  56.82,51.52 270 top
C140  0.1uF  [C0402]  67.12,57.67 0 top
C141  0.1uF  [C0402]  67.12,58.72 0 top
C142  0.1uF  [C0402]  67.11,59.76 0 top
C143  10uF,3.3V  [C0805]  67.86,61.5 0 top
C146  18pF  [C0402]  48.77,74.87 0 top
C147  18pF  [C0402]  45.86,74.89 180 top
C148  18pF  [C0402]  30.62,82.21 270 top
C149  18pF  [C0402]  30.79,86.75 90 top
C150  0.1uF  [C0402]  36.9,79.78 270 top
C151  0.1uF  [C0402]  27.88,64.1 90 top
C155  0.1uF  [C0402]  79.25,64.35 90 top
C156  18pF  [C0402]  76.61,57.16 270 top
C157  18pF  [C0402]  76.59,55.28 90 top
D1  MBRA340T3  [SMA]  9.26,33.45 180 top
D2  MBRA340T3  [SMA]  9.01,48.7 180 top
D3  MBRA340T3  [SMA]  8.86,65.7 180 top
D4  MBRA340T3  [SMA]  9.03,80 180 top
D5  MBRA340T3  [SMA]  19.16,35.75 180 top
EEPROM_WP  TPB1,27  [B1,27]  46.01,52.19 0 top
IC1  74AHC1G126DCK  [SC70-5]  56.46,66 270 top
IC2  CY7C65632  [QFN28]  76.01,62.3 0 top
IC6  74AHC1G126DCK  [SC70-5]  64.25,93.97 0 top
IC7  74AHC1G126DCK  [SC70-5]  73.77,92.58 0 top
IC29  LAN8710A  [32-QFN]  37.1,84.14 0 top
IC30  MTFC2GMDEA  [WFBGA]  59.21,58.98 90 top
J1  [CTI-JTAG]  20.16,54 270 top
J2  4P-2.0  [HW4-2.0]  21.01,74.85 0 top
J3  4P-2.0  [HW4-2.0]  58.11,74.7 0 top
JP1  FIDUCIAL1X2.5  [FIDUCIAL-1X2.5]  93.19,98.06 0 top
JP2  FIDUCIAL1X2.5  [FIDUCIAL-1X2.5]  3.38,8.01 0 top
L1  15uH  [NR8040T330]  18.03,42.55 90 top
L2  150OHM,800mA  [L2012C]  30.19,89.17 0 top
L3  150OHM,800mA  [L2012C]  58.24,47.52 0 top
LED0  blue  [CHIP-LED0603]  73.63,5.46 90 top
LED1  blue  [CHIP-LED0603]  11.81,71.3 180 top
LED2  blue  [CHIP-LED0603]  11.78,55.48 180 top
LED3  blue  [CHIP-LED0603]  11.83,39.17 180 top
LED4  blue  [CHIP-LED0603]  11.61,85.58 180 top
LED5  blue  [CHIP-LED0603]  79.14,5.46 90 top
LED6  blue  [CHIP-LED0603]  84.79,5.46 90 top
LED7  blue  [CHIP-LED0603]  90.3,5.46 90 top
LED8  blue  [CHIP-LED0603]  12.76,18.45 0 top
LED9  blue  [CHIP-LED0603]  97.74,21.84 270 top
LED10  blue  [CHIP-LED0603]  97.74,20.57 270 top
LED11  blue  [CHIP-LED0603]  97.74,19.34 270 top
LED12  blue  [CHIP-LED0603]  97.74,18.02 270 top
LED13  blue  [CHIP-LED0603]  97.74,16.66 270 top
LOGO1  OSHW_LOGO_FILLX0200-NT  [OSHW_FILLX200_NOTEXT]  68.84,77.54 0 top
MGT1  MOUNTING_HOLE  [MOUNTING_HOLE]  3.51,3.5 0 top
MGT2  MOUNTING_HOLE  [MOUNTING_HOLE]  3.51,96.5 0 top
MGT3  MOUNTING_HOLE  [MOUNTING_HOLE]  96.51,96.5 0 top
MGT4  MOUNTING_HOLE  [MOUNTING_HOLE]  96.51,3.5 0 top
PMIC_NRESET  TPTP10R  [TP10R]  50.74,75.36 0 top
Q1  AON6758  [8-DFN-EP-(5X6)]  8.53,55.73 270 top
Q2  AON6758  [8-DFN-EP-(5X6)]  8.71,71.42 270 top
Q3  AON6758  [8-DFN-EP-(5X6)]  8.63,39.02 270 top
Q4  [SOT23]  87.31,9.76 0 top
Q5  [SOT23]  90.84,9.73 0 top
Q6  [SOT23]  90.68,13.48 0 top
Q7  [SOT23]  87.36,13.51 0 top
Q8  AON6758  [8-DFN-EP-(5X6)]  8.46,85.67 270 top
Q9  MMBT2907  [SOT23-BEC]  19.41,68.15 0 top
Q10  DMC2038LVT  [TSOT26]  15.11,90.7 0 top
Q11  DMC2038LVT  [TSOT26]  18.51,90.7 0 top
Q12  [SOT23]  8.11,12.8 90 top
Q13  DMC2038LVT  [TSOT26]  21.91,90.75 0 top
Q14  DMC2038LVT  [TSOT26]  25.31,90.74 0 top
R1  10K,1%  [R0402]  22.71,61.3 270 top
R2  10K,1%  [R0402]  56.51,67.6 180 top
R3  0.1R  [R0805]  32.75,27.94 270 top
R4  0.1R  [R0805]  32.7,16.5 90 top
R5  4.7K,1%  [R0402]  84.49,16.28 0 top
R6  10K,1%  [R0402]  28.29,23.69 0 top
R7  0.1R  [R0805]  44.75,27.96 270 top
R8  0.1R  [R0805]  44.77,16.59 90 top
R9  0.1R  [R0805]  68.75,27.96 270 top
R10  0.1R  [R0805]  68.77,16.59 90 top
R11  0.1R  [R0805]  80.85,27.93 270 top
R12  100K,1%  [R0402]  27.68,36.6 90 top
R13  4.7K,1%  [R0402]  33.39,94.97 180 top
R14  4.7K,1%  [R0402]  11.78,73.6 90 top
R15  4.7K,1%  [R0402]  11.83,41.52 90 top
R16  4.7K,1%  [R0402]  11.81,57.88 90 top
R17  4.7K,1%  [R0402]  17.82,95.02 180 top
R18  4.7K,1%  [R0402]  9.47,95 180 top
R19  4.7K,1%  [R0402]  81.41,5.46 0 top
R20  4.7K,1%  [R0402]  87.05,5.46 0 top
R21  4.7K,1%  [R0402]  92.49,5.46 0 top
R22  13.3K,1%  [R0402]  28.98,36.6 270 top
R23  4.7K,1%  [R0402]  65.67,68.32 180 top
R24  4.7K,1%  [R0402]  9.81,18.2 180 top
R25  4.7K,1%  [R0402]  75.89,5.46 0 top
R26  0.001,1%  [R1206]  11.11,25.9 270 top
R27  10K,1%  [R0402]  40.27,24.66 180 top
R28  4.7K,1%  [R0402]  40.27,25.73 180 top
R29  0.1R  [R0805]  56.75,27.96 270 top
R30  0.1R  [R0805]  56.77,16.59 90 top
R31  10K,1%  [R0402]  64.26,23.57 180 top
R32  4.7K,1%  [R0402]  84.49,17.18 0 top
R33  4.7K,1%  [R0402]  84.5,18.03 0 top
R34  4.7K,1%  [R0402]  84.49,18.89 0 top
R35  10K,1%  [R0402]  52.37,24.61 180 top
R36  4.7K,1%  [R0402]  52.32,25.64 180 top
R37  10K,1%  [R0402]  28.29,24.84 180 top
R38  10K,1%  [R0402]  15.89,61.29 270 top
R39  10K,1%  [R0402]  26.01,61.34 270 top
R40  10K,1%  [R0402]  21.81,61.31 270 top
R41  40.2K,1%  [R0402]  15.61,64.8 0 top
R42  0.1R  [R0805]  80.84,16.64 90 top
R43  10K,1%  [R0402]  76.37,23.64 0 top
R44  4.7K,1%  [R0402]  76.36,25.7 180 top
R45  100K,1%  [R0402]  10.56,10.55 180 top
R46  4.7K,1%  [R0402]  8.16,61.77 180 top
R47  4.7K,1%  [R0402]  8.33,45.08 0 top
R48  4.7K,1%  [R0402]  8.23,77.47 180 top
R49  499  [R0402]  17.61,65.75 180 top
R50  10K,1%  [R0402]  64.24,24.69 0 top
R51  4.7K,1%  [R0402]  64.22,25.73 180 top
R52  2.2R  [R0402]  64.27,21.43 0 top
R53  1K,1%  [R0402]  7.86,18.2 180 top
R54  4.7K,1%  [R0402]  7.71,10.7 180 top
R55  10K,1%  [R0402]  25.11,61.35 270 top
R56  10K,1%  [R0402]  16.81,61.28 270 top
R57  10K,1%  [R0402]  19.61,61.27 270 top
R58  10K,1%  [R0402]  40.29,23.59 0 top
R59  2.2R  [R0402]  28.29,21.52 0 top
R60  10K,1%  [R0402]  52.36,23.57 0 top
R61  4.7K,1%  [R0402]  43.25,94.94 0 top
R62  4.7K,1%  [R0402]  50.14,94.99 180 top
R63  4.7K,1%  [R0402]  58.16,94.86 180 top
R64  4.7K,1%  [R0402]  66.76,94.31 270 top
R65  4.7K,1%  [R0402]  75.53,92.81 270 top
R66  4.7K,1%  [R0402]  83.27,94.95 0 top
R67  4.7K,1%  [R0402]  65.67,69.37 180 top
R68  4.7K,1%  [R0402]  65.69,70.5 180 top
R69  4.7K,1%  [R0402]  65.69,71.57 180 top
R70  2.2R  [R0402]  40.32,21.48 0 top
R71  2.2R  [R0402]  52.37,21.48 0 top
R72  2.2R  [R0402]  76.37,21.43 0 top
R73  10K,1%  [R0402]  76.37,24.66 180 top
R74  4.7K,1%  [R0402]  11.61,87.92 90 top
R75  4.7K,1%  [R0402]  8.25,91.83 180 top
R76  4.7K,1%  [R0402]  25.1,85.48 180 top
R77  4.7K,1%  [R0402]  25.42,94.94 180 top
R78  10K,1%  [R0402]  18.69,61.28 270 top
R79  470  [R0402]  91.45,93.03 180 top
R80  470  [R0402]  95.64,75.47 180 top
R81  10K,1%  [R0402]  41.1,82.5 180 top
R82  12.1K, 1%  [R0402]  35.14,88.69 270 top
R83  10,1%  [R0402]  31.42,84.87 180 top
R84  100K,1%  [R0402]  9.91,23.05 0 top
R85  100  [R0402]  40,77.1 90 top
R86  40.2K,1%  [R0402]  11.91,23.05 180 top
R87  100K,1%  [R0402]  72.11,60.5 270 top
R88  10K,1%  [R0402]  17.61,64.8 180 top
R89  4.7K,1%  [R0402]  65.66,66.83 180 top
R90  10K,1%  [R0402]  62.86,66 90 top
R91  4.7K,1%  [R0402]  11.01,12.65 90 top
R92  4.7K,1%  [R0402]  15.21,86.35 0 top
R93  4.7K,1%  [R0402]  15.21,85.5 0 top
R94  10K,1%  [R0402]  61.38,38.2 90 top
R95  100  [R0402]  32.54,77.1 270 top
R96  100  [R0402]  33.63,77.1 270 top
R97  100  [R0402]  34.68,77.1 270 top
R98  100  [R0402]  39.81,87.69 0 top
R99  100  [R0402]  35.74,77.1 270 top
R100  100  [R0402]  31.48,77.1 270 top
R101  100  [R0402]  36.81,77.1 270 top
R102  100  [R0402]  41.26,83.92 0 top
R103  100  [R0402]  38.93,77.1 270 top
R104  100  [R0402]  37.89,77.1 270 top
R105  100K,1%  [R0402]  34.91,51.73 0 top
R106  1K,1%  [R0402]  28.26,76.1 0 top
R107  100K,1%  [R0402]  34.91,50.02 0 top
R108  100K,1%  [R0402]  34.89,49.1 0 top
R109  1K,1%  [R0402]  28.26,77.1 0 top
R110  1K,1%  [R0402]  28.26,75.1 0 top
R111  1K,1%  [R0402]  28.26,79.95 0 top
R112  4.7K,1%  [R0402]  12.76,15.8 270 top
R113  649,1%  [R0402]  73.96,58 270 top
R114  100K,1%  [R0402]  34.91,50.87 180 top
R115  100K,1%  [R0402]  39.98,37.81 0 top
R116  100K,1%  [R0402]  40.53,36.84 0 top
R117  100K,1%  [R0402]  39.96,42.09 180 top
R118  100K,1%  [R0402]  39.94,40.69 180 top
R119  100K,1%  [R0402]  39.93,39.81 180 top
R120  100K,1%  [R0402]  39.93,38.92 180 top
R121  10K,1%  [R0402]  77.53,78.98 90 top
R122  49.9,1%  [R0402]  46.3,89.12 90 top
R123  49.9,1%  [R0402]  46.3,90.97 270 top
R124  49.9,1%  [R0402]  47.36,86.08 90 top
R125  49.9,1%  [R0402]  47.36,87.93 270 top
R126  2.2R  [R0402]  16.27,21.47 0 top
R127  10K,1%  [R0402]  58.95,51.52 270 top
R128  10K,1%  [R0402]  54.7,51.52 270 top
R129  10K,1%  [R0402]  53.62,51.52 270 top
R130  10K,1%  [R0402]  55.77,51.52 270 top
R131  10K,1%  [R0402]  50.45,51.52 270 top
R132  10K,1%  [R0402]  57.9,51.52 270 top
R133  10K,1%  [R0402]  52.57,51.52 270 top
R134  10K,1%  [R0402]  51.52,51.52 270 top
R135  10K,1%  [R0402]  62.16,51.52 270 top
R136  10K,1%  [R0402]  61.07,51.51 270 top
R137  10K,1%  [R0402]  60.02,51.52 270 top
R138  0.1R  [R0805]  20.77,27.94 270 top
R139  0.1R  [R0805]  20.78,16.6 90 top
R140  10K,1%  [R0402]  16.28,24.87 180 top
R141  10K,1%  [R0402]  16.28,23.75 0 top
R142  4.7K,1%  [R0402]  15.21,84.5 0 top
R143  4.7K,1%  [R0402]  16.26,26 0 top
R144  4.7K,1%  [R0402]  28.31,25.85 0 top
R145  4.7K,1%  [R0402]  7.86,30.15 0 top
R146  47k,NTC  [R0402]  7.86,29 180 top
R147  10K,1%  [R0402]  80.16,64.35 90 top
R148  40.2K,1%  [R0402]  79.26,62.35 90 top
R149  0.1R  [R0805]  90.22,40.08 90 top
R150  1M  [R0402]  47.33,75.97 180 top
R151  0,DNP  [R0402]  30.16,36.55 90 top
R152  10K,1%  [R0402]  44.13,75.59 90 top
R153  1K,1%  [R0402]  28.26,79 0 top
R154  1K,1%  [R0402]  28.26,78.05 0 top
R155  1K,1%  [R0402]  28.26,80.9 0 top
R161  100  [R0402]  6.76,43.75 90 top
R162  100  [R0402]  6.81,76.15 90 top
R171  4.7K,1%  [R0402]  28.21,52.1 90 top
R172  4.7K,1%  [R0402]  29.11,52.1 90 top
R173  4.7K,1%  [R0402]  27.31,52.1 90 top
R174  100K,1%  [R0402]  34.91,48.1 0 top
R175  100K,1%  [R0402]  35.56,47.1 0 top
R176  100K,1%  [R0402]  36.61,46.05 0 top
R177  100K,1%  [R0402]  37.46,45 0 top
R178  100K,1%  [R0402]  38.46,44.05 0 top
R179  100K,1%  [R0402]  39.66,43.15 0 top
R180  100  [R0402]  6.61,60.35 90 top
R181  100  [R0402]  6.56,90.15 90 top
SV1  [MA04-1]  20.91,78.85 180 top
SV4  [MA05-2]  68.96,33.6 0 top
SV5  [MA04-1]  55.11,32.65 0 top
SV6  [MA05-2]  39.51,33.6 0 top
SYS_5V  TPTP06R  [TP06R]  65.18,47.77 0 top
SYS_RTC_1V8  TPB1,27  [B1,27]  21.87,66.28 0 top
SYS_VDD1_3V3  TPTP10R  [TP10R]  33.33,50.88 0 top
SYS_VDD2_3V3  TPTP11R  [TP11R]  21.49,71.63 0 top
SYS_VDD3_3V3  TPB1,27  [B1,27]  20.3,65.16 0 top
U1  OSD3358-512M-BSM  [OSD335X-BGA-256]  40.92,63.58 0 top
U3  TPS2061D  [SOIC127P600X175-8N]  76.01,72.85 0 top
U4  TPD4S012_DRY_6_P1_P  [DRY6]  81.91,68.1 90 top
U5  UA78L05ACD  [SOIC127P600X175-8N]  68.11,88.65 270 top
U6  TPD4S012_DRY_6_P1_P  [DRY6]  81.91,51.15 0 top
U7  TLVH431  [SOT23-3]  16.11,68.1 0 top
U8  TPD4S012_DRY_6_P1_P  [DRY6]  81.96,71.75 0 top
U9  TPD4S012_DRY_6_P1_P  [DRY6]  81.91,48.65 0 top
U10  TPD4S012_DRY_6_P1_P  [DRY6]  89.71,19.75 90 top
U11  SN74AHC595PW  [SOP65P640X120-16N]  20.26,83.9 0 top
U12  APX811SOT  [SOT143-R]  59.56,66.35 180 top
U13  INA199A1DCKR  [SOT65P210X110-6N]  8.11,26.3 0 top
U19  CD4050BD  [SOIC127P600X175-16N]  58.56,88.44 270 top
U$1  [LOGO_BIG]  52.96,80.42 0 top
U$2  TRINAMIC_TMC2130_QFN36  [TRINAMIC_QFN36]  20.53,22.25 180 top
U$3  LPJ0011BBNL  [LPJ0011BBNL]  90.17,84.44 90 top
U$4  CC-BY-SA  [CC-BY-SA]  26.23,89.12 0 top
U$5  USB-A  [USB-A]  90.31,50.33 90 top
U$6  USB-A  [USB-A]  90.31,67.33 90 top
U$7  TDA19988BHN/C1,557  [SOT804-4]  52.11,41.09 0 top
U$8  USB-MICRO  [USB-MICRO]  98.12,11.49 90 top
U$9  TRINAMIC_TMC2130_QFN36  [TRINAMIC_QFN36]  44.51,22.25 180 top
U$10  TPS54202  [SOT23']  28.94,39.33 270 top
U$11  SISS27DN  [POWERPAK-1212-8S]  8.96,20.95 180 top
U$12  [BB-LOGO]  63.61,76.65 0 top
U$13  TRINAMIC_TMC2130_QFN36  [TRINAMIC_QFN36]  32.5,22.25 180 top
U$14  TRINAMIC_TMC2130_QFN36  [TRINAMIC_QFN36]  56.51,22.25 180 top
U$15  TRINAMIC_TMC2130_QFN36  [TRINAMIC_QFN36]  68.51,22.25 180 top
U$16  TRINAMIC_TMC2130_QFN36  [TRINAMIC_QFN36]  80.61,22.25 180 top
U$17  SISS27DN  [POWERPAK-1212-8S]  8.96,16.05 180 top
U$18  TPD12S016-RKT  [R-PDSO-G24]  79.36,35.75 270 top
U$19  TACT_SWITCH  [DHT-1147]  93.46,18.95 90 top
U$20  TACT_SWITCH  [DHT-1147]  63.11,45.05 180 top
U$21  TACT_SWITCH  [DHT-1147]  33.66,40.55 0 top
U$22  445C33D24M000003.2X2.5  [403C35E12M00000]  78.41,56.2 90 top
U$23  [S_LOGO]  56.16,78 0 top
VDD_CODE  TPTP10R  [TP10R]  33.35,49.45 0 top
VDD_MPU  TPTP11R  [TP11R]  29.69,74.21 0 top
VDDS_DDR  TPTP10R  [TP10R]  33.39,48.05 0 top
VDDS_PLL  TPTP11R  [TP11R]  30.95,75.1 0 top
X1  22-05-7038-03  [7395-03]  53.22,97.19 180 top
X2  MSTBA4  [MSTBA4]  -1.39,20.55 270 top
X3  MSTBA2  [MSTBA2]  -1.39,37.95 270 top
X4  22-05-7028-02  [7395-02]  79.22,3.27 0 top
X5  22-05-7028-02  [7395-02]  84.77,3.27 0 top
X6  22-05-7028-02  [7395-02]  90.28,3.27 0 top
X7  22-05-7038-03  [7395-03]  19.42,97.18 180 top
X8  22-05-7038-03  [7395-03]  35.65,97.14 180 top
X9  22-05-7028-02  [7395-02]  73.65,3.27 0 top
X10  22-05-7038-03  [7395-03]  69.26,97.17 180 top
X11  22-05-7038-03  [7395-03]  27.53,97.1 180 top
X12  22-05-7048-04  [7395-04]  86.54,97.19 180 top
X13  22-05-7038-03  [7395-03]  61.26,97.19 180 top
X14  22-05-7048-04  [7395-04]  12.28,3.23 0 top
X15  22-05-7048-04  [7395-04]  22.76,3.25 0 top
X16  22-05-7048-04  [7395-04]  33.23,3.27 0 top
X17  22-05-7048-04  [7395-04]  43.73,3.27 0 top
X18  22-05-7048-04  [7395-04]  54.23,3.27 0 top
X19  22-05-7038-03  [7395-03]  77.26,97.19 180 top
X20  MSTBA4  [MSTBA4]  -1.39,55.35 270 top
X21  MSTBA2  [MSTBA2]  -1.39,72.75 270 top
X22  22-05-7038-03  [7395-03]  45.24,97.17 180 top
X24  HDMI4  [HDMI-A-TH]  97.79,31.79 90 top
X25  22-05-7048-04  [7395-04]  64.74,3.27 0 top
X26  MSTBA2  [MSTBA2]  -1.42,85.1 270 top
X29  22-05-7038-03  [7395-03]  11.34,97.23 180 top
Y1  25MHz  [445C33D24M00000]  47.4,78.07 180 top
Y2  25MHz  [445C33D24M00000]  28.46,84.8 270 top

## Tracks (layer width: path | path; a pad name or v marks a point on that pad's centre or on a via)
5VIN_Y
  Top 0.15: U$13.26 29.66,21 29.46,21.2 29.26,21.2 | 29.26,21.2 R59.2 | 29.26,21.2 28.96,21.2 28.91,21.25 28.91,20.45 C72.1
5VOUT_A
  Top 0.15: U$16.25 77.71,21.5 77.61,21.6 77.61,22.05 77.46,22.2 77.18,22.2 C55.2 | R72.1 76.09,21.43 76.36,21.7 76.36,22.5 76.86,22.5 C55.2 | C55.2 76.35,22.51 76.36,22.55 76.36,24.25 76.16,24.45 75.81,24.45 R73.2
5VOUT_E
  Top 0.15: U$14.25 53.66,21.5 53.51,21.65 53.51,22.25 53.46,22.3 53.2,22.3 C65.2 52.95,22.55 52.46,22.55 | R71.1 52.14,21.48 52.36,21.7 52.36,22.45 52.46,22.55 | R35.2 52.2,24.61 52.36,24.45 52.36,22.65 52.46,22.55
5VOUT_H
  Top 0.15: R31.2 64.13,23.57 64.26,23.45 64.26,22.65 64.36,22.55 64.85,22.55 C68.2 | C68.2 64.44,22.48 64.28,22.31 64.28,21.57 64.16,21.45 63.63,21.45 R52.1 | U$15.25 65.61,21.5 65.51,21.6 65.51,22.1 65.46,22.15 65.25,22.15 C68.2
5VOUT_X
  Top 0.15: U$2.25 17.63,21.5 17.54,21.59 17.54,22.06 17.36,22.24 17.13,22.24 C86.2 16.41,22.6 | 16.41,22.6 16.29,22.73 16.29,24.75 16.16,24.87 R140.2 | 16.41,22.6 16.35,22.6 16.28,22.53 16.28,21.55 16.2,21.47 R126.1
5VOUT_Y
  Top 0.15: U$13.25 29.61,21.5 29.52,21.58 29.52,22.18 29.41,22.3 29.16,22.3 C33.2 28.8,22.55 28.36,22.55 | R59.1 28.17,21.57 28.31,21.7 28.31,22.5 28.36,22.55 | 28.36,22.55 28.31,22.55 28.31,24.65 28.16,24.8 27.59,24.8 R37.2
5VOUT_Z
  Top 0.15: R70.1 40.04,21.68 40.29,21.93 40.29,22.06 | 40.29,22.06 40.29,22.54 C37.2 40.9,22.5 41.36,22.5 41.46,22.4 41.46,21.75 41.71,21.5 U$9.25 | 40.29,22.06 40.29,24.12 40.01,24.4 39.83,24.4 R27.2
+5V  (via drill 0.3)
  Top 0.25: U1.T10 51.39,65.48 v51.66,65.45
  Top 0.3: R12.1 C36.2 25.86,36.05 v25.81,36
  Bottom 0.25: v25.81,36 25.71,36 24.41,37.3 22.41,37.3 21.41,38.3 v21.41,43.85
  other vias: 52.66,65.45 53.81,65.45 16.36,47.15 19.81,47.15 18.76,47.2 17.41,47.15
  pour Top (no thermals): 14.31,48.2 14.31,43.6 20.51,43.55 24.81,43.55 24.81,48.15
  pour Top: 47.66,64.8 47.66,66.25 54.46,66.25 54.46,64.8
  pour VCC: 14.21,43.25 14.21,60.65 33.56,60.65 33.61,66.7 35.86,66.7 36.51,66.05 43.16,66.05 43.76,66.65 54.31,66.65 54.31,64.85 47.06,64.8 47.06,63.95 40.96,63.95 40.96,62.95 35.66,62.95 35.56,53.55 29.96,53.55 29.86,43.3
+12V  (via drill 0.3)
  Top 0.25: U5.1 70.21,91 70.22,91.01 70.59,91.01 v70.66,90.95 70.71,90.9 C5.2 | 70.81,90.9 C5.2 | X12.4 90.41,97.12 90.41,95.2 89.71,94.5 86.41,94.5 84.81,92.9 78.06,92.9 75.66,90.5 72.56,90.5 72.16,90.9 C5.2
+24V  (via drill 0.3)
  Top 0.15: R26.1 11.11,26.4 11.01,26.3 U13.5 | 65.23,10.25 65.23,10.41 C98.+ | 53.28,10.3 53.28,10.28 C97.+ | C94.+ | C95.+ 29.28,10.25 | 10.81,65.55 10.81,65.65 D3.C
  Top 0.25: U$2.31 19.78,18.94 | 19.78,18.94 19.53,18.7 | 19.56,18.7 19.53,18.7 | 19.53,18.7 19.41,18.7 | 19.41,18.7 19.34,18.7 19.29,18.75 19.29,19.31 U$2.30 | C99.2 17.62,16.8 17.62,17.03 17.69,17.09 18.03,17.09 18.33,17.39 18.34,17.58 18.43,17.67 C85.2 v18.56,18.55 v19.16,18.55 | 19.78,18.94 19.56,18.7 | 19.56,18.7 v19.16,18.55 | v19.16,18.55 19.26,18.55 19.41,18.7 | C41.1 17.78,26.82 C15.1 18.61,26.71 18.61,26.65 | U$13.31 31.75,18.89 31.56,18.7 31.31,18.7 31.26,18.75 U$13.30 31.25,18.84 v31.21,18.6 v30.51,18.6 | v30.51,18.6 30.51,17.89 C4.1 | C4.1 30.55,18.5 v30.51,18.6 | C35.2 29.48,17.07 29.56,17.15 30.01,17.15 30.33,17.47 30.33,17.75 C4.1 | U$9.31 43.76,18.9 43.56,18.7 43.31,18.7 v43.16,18.6 43.26,18.65 U$9.30 | 43.06,18.6 v42.61,18.6 42.61,17.75 C8.1 42.62,17.54 42.62,17.41 42.47,17.23 42.29,17.23 42.21,17.15 41.86,17.15 41.67,16.96 C38.2 | 18.61,26.65 v18.61,25.91 19.48,25.91 19.78,25.61 U$2.16 | 18.61,26.65 18.86,26.7 | U$13.16 31.75,25.56 31.4,25.91 v31.15,25.91 30.76,25.91 | 30.76,25.91 30.76,26.64 C28.2 29.33,26.75 C89.1 | 30.76,25.91 v30.51,25.91 | U$14.31 55.76,18.95 55.66,18.85 55.26,18.85 | 54.56,18.07 v54.56,18.6 v55.11,18.6 55.26,18.85 | 54.56,18.07 C64.2 | 54.56,18.07 54.56,17.35 54.46,17.25 54.26,17.25 54.16,17.15 53.61,17.15 53.56,17.1 53.56,16.57 C66.2 | U$14.30 55.26,18.85 | U$14.16 55.76,25.6 55.45,25.91 v55.21,25.91 v54.56,25.91 54.56,26.62 C40.1 53.45,26.54 C92.1 | U$9.16 43.76,25.6 43.45,25.91 v43.26,25.91 v42.66,25.91 42.66,26.73 | 42.66,26.73 C32.2 | U$15.31 67.76,18.95 67.51,18.7 67.31,18.7 67.26,18.75 U$15.30 v67.26,18.59 v66.71,18.59 66.71,17.88 C10.1 66.67,17.32 66.61,17.25 66.21,17.25 66.11,17.15 65.71,17.15 65.61,17.05 65.61,16.55 C69.2
  Top 0.25: U$15.16 67.76,25.6 67.46,25.9 v67.16,25.91 v66.56,25.91 66.56,26.68 C67.2 65.6,26.69 C93.1 | U$16.31 79.86,18.96 79.65,18.75 79.41,18.75 79.36,18.8 U$16.30 v79.36,18.64 78.83,18.64 v78.76,18.59 78.76,18.02 C16.1 78.76,17.8 78.76,17.3 78.71,17.25 78.26,17.25 78.16,17.15 77.71,17.15 77.6,17.04 C56.2 | U$16.16 79.86,25.55 79.51,25.9 v79.35,25.91 | v78.76,25.91 78.76,26.55 | 78.76,26.55 C54.2 | 78.76,26.55 77.66,26.55 C100.1 | 42.66,26.73 41.51,26.73 C91.1 | U5.8 69.92,86.19 | C101.+ 77.3,10.23 77.33,10.2 | D2.C 11.01,48.55 | D4.C 11.03,79.97 10.96,79.9 | 11.96,31.7 v11.96,31.65
  Top 0.3: C42.+ 17.28,8.42 v17.26,8.4 | v18.01,8.4 18.01,9.8 17.86,10 16.81,10 16.51,9.7 v16.51,8.4 | 29.28,10.3 29.28,10.25 29.28,8.47 v29.26,8.45 | v30.01,8.45 30.01,9.85 29.86,10.05 28.81,10.05 28.51,9.75 v28.51,8.45 | C94.+ 41.28,8.42 v41.26,8.4 | v42.01,8.4 42.01,9.8 41.86,10 40.81,10 40.51,9.7 v40.51,8.4 | 53.28,10.3 53.28,8.47 v53.26,8.45 | v54.01,8.45 54.01,9.85 53.86,10.05 52.81,10.05 52.51,9.75 v52.51,8.45 | 65.23,10.25 65.23,8.57 v65.21,8.5 | v65.96,8.55 65.96,9.8 65.81,10 64.76,10 64.46,9.7 v64.46,8.5 | 77.33,10.2 77.33,8.37 v77.31,8.35 | v78.06,8.35 78.06,9.75 77.91,9.95 76.86,9.95 76.56,9.65 v76.56,8.35 | 70.14,86.25 69.92,86.19 | v69.31,84.7 69.76,84.7 70.01,84.95 U5.8 70.03,86.2 C6.2 | R26.1 10.99,27.32 | v78.76,25.91 v78.76,25.9 v79.36,25.9 v79.35,25.91 | D1.C 10.76,32.7 | 10.96,79.9 10.26,79.2 v10.26,78.55 | v11.01,78.55 11.01,79.8 | v11.71,78.55 11.71,79.65 | 10.81,65.55 10.11,64.85 v10.11,64.2 | v10.86,64.2 10.86,65.45 | v11.56,64.2 11.56,65.3 | 11.01,48.55 10.31,47.85 v10.31,47.2 | v11.06,47.2 11.06,48.45 | v11.76,47.2 11.76,48.3
  Top 0.5: 10.76,32.7 10.51,32.7 v10.51,31.65 | v11.26,31.65 11.26,33.2 11.21,33.25 | 11.96,31.7 11.96,32.8
  Bottom 0.3: v69.31,84.7 69.35,84.66 69.35,74.14 68.36,73.15 68.36,70.5 69.76,69.1 69.76,66.2 69.41,65.85 69.41,52.7 80.41,41.7 | 80.46,41.65 80.41,41.7 | 80.41,41.7 90.16,32 v90.16,26.85 | v10.51,31.65 10.56,31.75 | v10.26,78.55 10.31,78.6 | v10.11,64.2 10.16,64.25 | v10.31,47.2 10.36,47.25
  Bottom 0.5: 12.26,31.65 12.21,31.75
  other vias: 19.25,25.91 10.71,28.65 11.41,28.65 12.11,28.65 10.71,29.45 11.41,29.45 12.11,29.45 10.01,29.5 9.36,29.5 9.36,28.6 10.01,28.6
  pour VCC (no thermals): 0.15,90.96 13.31,90.97 13.26,30.85 30.61,30.9 30.66,33 45.21,33.05 45.31,31.05 65.76,30.9 65.76,32.65 74.86,32.75 74.86,29.1 87.81,29.2 87.83,29.2 87.86,27.45 90.61,27.45 90.61,26.1 87.86,26.1 87.71,7 99.81,7 100.01,0.35 88.16,0.4 0.01,0 0.16,8.78 14.26,8.72 14.26,20.55 0.21,20.55
  pour Bottom (isolate 0.152, no thermals): 1.68,92.5 13.01,92.47 13.01,31.15 12.58,30.65 1.51,30.65 1.51,92.5
  pour Top (no thermals): 12.91,26.6 8.96,26.6 8.96,30 12.91,30
+24V_FOR_5V
  Top 0.25: C1.2 27.62,38.5 U$10.3
  pour Top (no thermals): 20.06,34.65 20.06,37.1 21.31,38.35 22.31,38.35 21.81,38.7 24.56,38.7 24.71,38.55 30.51,38.45 30.51,34.65
CGND
  pour Top: 101.01,15 95.26,15.05 95.21,17.05 95.21,23.35 92.61,23.35 92.56,25.9 95.01,25.9 95.01,37.65 91.76,37.65 91.76,40.45 82.56,40.45 82.51,45.45 89.21,45.45 89.26,54.9 82.86,54.9 82.76,62.3 89.56,62.3 89.61,71 83.11,71 83.16,75.95 90.36,75.95 90.36,91.8 84.31,91.8 84.31,94.05 91.86,94.05 91.86,99.01 7.01,99 7.01,93 -0.99,93 -0.99,101 101.01,101
  pour Top: -0.99,-1 101.01,-1 101.01,15.4 95.21,15.4 95.21,7 93.01,7 93.01,1 7.01,1 7.01,6.85 1.01,6.85 1.01,93 -0.99,93
  pour Bottom: 7.01,93 7.01,99 93.01,99 93.01,93 97.61,93 97.61,7 93.01,7 93.01,1 7.01,1 7.01,-1 101.01,-1 101.01,101 -0.99,101 -0.99,93
  pour Bottom: -0.99,-1 -0.99,93 1.01,93 1.01,7 7.01,7 7.01,-1
DIR_A  (via drill 0.3)
  Top 0.15: U$16.7 84.81,23 85.11,23.3 85.11,25.95 82.81,28.25 v82.81,29.15 | U1.A16 27.3,73.11 v27.26,73.15 | v28.76,31.55 31.66,31.55 v31.81,31.7
  Bottom 0.15: v27.26,73.15 27.26,67.2 27.31,67.15 27.31,50.6 28.11,49.8 28.11,42.65 29.51,41.25 29.51,35.15 28.91,34.55 28.91,31.65 v28.76,31.55 | v82.81,29.15 74.06,29.15 73.31,29.9 72.76,29.9 72.36,29.5 63.96,29.5 63.71,29.75 61.36,29.75 61.11,30 60.61,30 60.36,29.75 58.71,29.75 58.41,29.45 52.51,29.45 51.66,30.3 48.71,30.3 48.21,29.8 46.56,29.8 46.21,29.55 40.41,29.55 40.25,29.65 39.41,29.65 39.28,29.78 38.41,29.78 38.26,29.95 36.46,29.95 36.16,29.65 34.06,29.65 33.31,30.4 32.91,30.4 31.81,31.5 v31.81,31.7
DIR_B  (via drill 0.3)
  Top 0.15: 32.64,71.83 U1.B15 32.75,71.75 v33.27,71.75
  Bottom 0.15: v33.27,71.75 33.86,71.15 33.86,65.45 33.41,64.95 33.41,62.7 34.81,61.3 34.81,54.75 34.61,54.55 34.61,52.65 34.21,52.25 34.21,45.75 37.86,42.1 37.86,37.5 39.51,35.9 39.91,35.9 40.61,35.2 40.61,33.6 39.51,32.5 SV6.5
DIR_C  (via drill 0.3)
  Top 0.15: U1.R6 48.96,60.41 v48.36,59.8 | v70.41,31.2 69.28,32.33 SV4.5
  Bottom 0.15: v48.36,59.8 48.01,59.8 47.61,59.4 47.61,57.05 48.11,56.55 48.11,48.35 47.96,48.2 47.96,32.45 49.16,31.25 60.91,31.25 61.26,30.9 69.96,30.9 70.06,31 | 70.06,31 70.05,31 | 70.06,31 70.26,31.2 v70.41,31.2
DIR_E  (via drill 0.3)
  Top 0.15: U$14.7 60.64,23 60.95,23.31 60.95,25.66 60.26,26.35 v60.26,30.4 | U1.C4 33.57,57.87 v33.35,58.04 | v38.49,31.65 38.54,31.5 38.81,31.25 45.11,31.25 45.76,31.9 45.76,32.15 v46.51,32.9
  Bottom 0.15: v33.35,58.04 33.36,57.7 33.86,57.2 33.86,55.3 33.66,55.1 33.66,53.1 33.31,52.75 33.31,45.3 36.46,42.15 36.46,39.8 36.51,39.75 36.51,38 37.21,37.3 37.21,37 38.21,36 38.21,34 38.39,33.8 38.39,33.15 38.21,32.95 38.21,31.95 v38.49,31.65 | v46.51,32.9 46.61,32.9 48.91,30.6 59.96,30.6 v60.26,30.4
DIR_H  (via drill 0.3)
  Top 0.15: U1.C16 33.93,72.97 33.73,72.97 33.21,72.45 v29.71,72.45 | U$15.7 72.71,23 73.01,23.3 73.01,26.1 72.61,26.5 v72.61,27.55 | v38.11,26.55 38.11,27.75 v36.95,28.99
  Bottom 0.15: v72.61,27.55 72.01,27.55 71.76,27.8 61.41,27.8 61.36,27.85 60.91,27.85 60.86,27.8 51.91,27.8 51.31,27.2 50.81,27.2 50.7,27.16 44.51,27.15 44.31,27.3 44.21,27.35 40.36,27.35 40.01,27 38.81,27 38.36,26.55 v38.11,26.55 | v36.95,28.99 36.91,29.05 33.91,29.05 33.71,28.9 31.81,28.9 31.46,29.25 31.46,30.55 30.51,31.5 30.51,33.55 30.96,34 30.96,42 29.51,43.45 29.51,50.3 28.51,51.3 28.51,58.65 29.16,59.3 29.16,63.05 29.36,63.25 29.36,70.3 29.11,70.55 29.11,71.85 v29.71,72.45
DIR_X  (via drill 0.3)
  Top 0.15: U$2.7 24.76,23 24.97,23.2 24.97,26.48 24.52,26.92 24.52,30.4 26.46,32.35 30.56,32.35 v31.36,33.15 | U1.A2 29.37,55.33 v29.36,55.32
  Bottom 0.15: v31.36,33.15 31.56,33.3 31.56,42.45 30.11,43.9 30.11,50.6 29.21,51.5 29.21,55.19 v29.36,55.32
DIR_Y  (via drill 0.3)
  Top 0.15: U$13.7 36.63,23 36.94,23.31 36.94,25.67 36.11,26.5 36.11,28.5 35.61,29 35.61,33.14 35.41,33.34 35.41,33.6 35.91,34.2 v35.91,37.4 | U1.B1 32.66,53.66 32.81,53.55 32.82,53.45 v32.84,53.44
  Bottom 0.15: v32.84,53.44 v32.84,53.43 32.66,53.25 32.66,45.05 35.76,41.95 35.76,39.5 35.91,39.35 v35.91,37.4
DIR_Z  (via drill 0.3)
  Top 0.15: U$9.7 48.81,23 48.98,23.18 48.97,25.73 48.1,26.6 48.11,28.9 v46.41,30.6 | U1.B3 32.31,56.59 v32.06,56.85
  Bottom 0.15: v32.06,56.85 31.06,56 31.06,54.4 30.26,53.6 30.26,51.85 31.06,51.05 31.06,44.4 32.46,43 32.46,32.7 33.21,31.95 33.21,31.55 33.41,31.35 33.76,31.35 34.56,30.55 35.61,30.55 35.91,30.85 38.91,30.85 39.01,30.95 46.06,30.95 v46.41,30.6
DVI_+5V  (via drill 0.3)
  Top 0.15: v84.11,30.15 84.31,30.35 86.46,30.35 87.46,29.35 89.46,29.35 90.76,28.05 X24.18 | v83.32,32.15 83.28,32.17 U$18.P$13
  Top 0.3: U$18.P$13 83.98,32.17 C21.1
  Bottom 0.15: v84.11,30.15 83.32,30.93 v83.32,32.15
EEPROM_WP
  Top 0.15: U1.M2 45.78,55.33 46.41,54.7 46.86,54.7 47.26,54.3 47.26,53.45 47.26,53.44 EEPROM_WP.TP
EMMC_RST  (via drill 0.3)
  Top 0.15: IC30.K5 60.46,57.69 59.96,57.18 59.96,52.9 | 59.96,52.25 59.91,52.19 R137.1 59.96,52.13 59.96,52.25 | U1.B4 32.19,57.87 v32.06,58 | v62.01,50.1 v60.01,50.1 | 59.96,52.25 59.96,52.9 | 59.96,52.9 v59.98,52.92
  VCC 0.15: v32.06,58 32.31,58.1 32.73,58.52 34.63,58.52 35.41,59.3 35.41,62.55 35.71,62.85 41.06,62.85 41.36,62.55 41.36,59.85 41.56,59.65 45.36,59.65 45.71,59.3 49.41,59.3 49.61,59.1 50.06,59.1 50.36,59.4 53.56,59.4 54.01,58.95 54.61,58.95 55.21,59.55 55.21,61.5 55.41,61.7 59.41,61.7 v60.46,62.8
  Bottom 0.15: v60.46,62.8 60.46,61 62.36,59.1 62.36,56.45 62.76,56.05 62.76,54.4 62.21,53.85 62.21,50.25 v62.01,50.1 | v60.01,50.1 60.01,52.9 v59.98,52.92
EMMV_VCCI
  Top 0.2: IC30.C2 56.96,52.73 56.96,52.2 56.93,52.17 C138.1
EMU0  (via drill 0.3)
  Top 0.15: U1.E2 36.38,55.33 35.61,54.54 28.21,54.54 | 28.21,54.54 27.3,54.54 26.41,53.65 19.01,53.65 v18.81,53.45 | v18.61,54.75 18.61,54.8 18.26,55.15 J1.13 | R171.2 28.21,54.54
  Bottom 0.15: v18.81,53.45 18.61,53.65 v18.61,54.75
EMU1  (via drill 0.3)
  Top 0.15: U1.E3 36.25,56.4 35.71,55.85 35.71,55.15 35.4,54.84 26.85,54.84 v26.31,54.3 25.96,53.95 18.56,53.95 18.26,53.65 J1.14 | v26.64,52.1 28.66,52.1 29.11,52.55 R172.2
  Bottom 0.15: v26.64,52.1 26.64,52.32 26.31,52.65 v26.31,54.3
EN_TK_A  (via drill 0.3)
  Top 0.15: R142.2 16.16,84.5 16.41,84.75 17.32,84.75 U11.3 18.59,84.86 v18.76,84.7 | v27.51,89.65 Q14.3 26.26,88.45 26.06,88.25 24.91,88.25 24.41,88.75 | v18.56,87.7 19.81,87.7 19.96,87.85 23.51,87.85 24.41,88.75 | 24.41,88.75 24.41,89.7 Q14.1
  Bottom 0.15: X11.1 25.01,96.45 25.49,95.97 25.49,94.32 27.51,92.35 v27.51,89.65 | v18.76,84.7 18.76,85.1 18.96,85.3 18.96,86.65 18.56,87.05 v18.56,87.7
EN_TK_E  (via drill 0.3)
  Top 0.15: R76.2 24.44,85.53 U11.15 23.15,85.45 21.56,85.45 20.26,86.75 18.16,86.75 16.06,88.85 Q10.3 16.06,90.2 15.91,90.35 14.31,90.35 14.16,90.2 Q10.1 v13.36,89.65
  Bottom 0.15: X29.1 8.81,96.85 13.36,92.3 v13.36,89.65
EN_TK_H  (via drill 0.3)
  Top 0.15: R92.2 15.86,86.25 16.36,86.25 16.42,86.19 U11.1 18.47,86.19 v18.46,86.2 | Q11.1 17.56,89.15 v18.01,88.7 18.51,88.2 19.16,88.2 19.46,88.5 Q11.3
  Bottom 0.15: X7.1 16.86,97.15 16.86,95.95 18.46,94.35 18.46,89.15 v18.01,88.7 18.01,86.8 18.46,86.35 v18.46,86.2
EN_TK_HBP  (via drill 0.3)
  Top 0.15: 22.86,90.5 21.06,90.5 20.96,90.4 Q13.1 21.01,89.7 v21.01,88.65 | 22.86,90.5 Q13.3 | v20.81,85.43 U11.2 15.78,85.53 R93.2 | v31.31,90.65 27.21,90.65 27.06,90.5 22.86,90.5
  Bottom 0.15: v21.01,88.65 21.01,85.63 v20.81,85.43 | X8.1 32.5,97.09 31.75,97.09 31.31,96.65 v31.31,90.65
ENABLE_B  (via drill 0.3)
  Top 0.15: v33.31,37.65 33.31,36.55 30.76,34 17.01,34 v16.16,33.15 | U11.6 16.31,82.94 16.2,82.83 15.52,82.83 v15.51,82.85
  Bottom 0.15: v33.31,37.65 33.06,37.35 33.06,34.1 33.79,33.38 35.29,33.38 36.34,32.33 SV6.3 | v16.16,33.15 15.86,33.45 15.86,59.6 16.16,59.9 16.16,72.85 15.66,73.35 15.66,82.7 v15.51,82.85
ENABLE_C  (via drill 0.3)
  Top 0.15: v64.91,81.3 64.71,81.3 64.51,81.1 53.46,81.1 50.76,83.8 47.26,83.8 43.41,87.65 43.41,88.1 43.01,88.5 40.31,88.5 v39.61,89.2 | v20.21,82.15 17.36,82.15 U11.7 | v39.26,91.55 39.26,91.6 38.61,92.25 v29.01,92.25 | v20.21,87.3 26.21,87.3 27.06,88.2 28.21,88.2 v28.31,88.1
  Bottom 0.15: v39.61,89.2 39.26,89.55 v39.26,91.55 | v20.21,87.3 v20.21,82.15 | v64.91,81.3 65.11,81.1 65.11,73.65 63.31,71.85 63.31,70.25 64.51,69.05 64.51,63.5 64.71,63.3 64.71,53.95 63.86,53.1 63.86,39.95 67.51,36.45 67.51,33.6 66.42,32.51 SV4.3 | v28.31,88.1 28.31,88.45 28.66,88.8 28.66,91.9 v29.01,92.25
ENABLE_STUFF  (via drill 0.3)
  Top 0.15: U1.J15 41.55,71.34 40.96,70.75 40.96,70.45 40.46,69.95 40.06,69.95 39.66,69.55 39.66,69.15 39.33,68.81 35.73,68.81 35.46,68.55 33.66,68.55 33.46,68.35 33.06,68.35 32.57,68.82 27.84,68.82 27.81,68.85 22.86,68.84 21.26,70.45 v14.51,70.45 | R112.2 12.76,14.65 12.01,13.9 12.01,12.15 v12.06,12.1 R91.1 9.51,12.1 Q12.1
  Bottom 0.15: v14.51,70.45 14.51,64 14.66,63.85 14.66,60.25 15.01,59.9 15.01,54.5 14.71,54.2 14.71,29.6 13.86,28.75 13.86,13.95
  Bottom 0.154: 13.86,13.95 v12.06,12.1